# Altium project MEA_CLDP.PrjPcb (part 1 of 2)
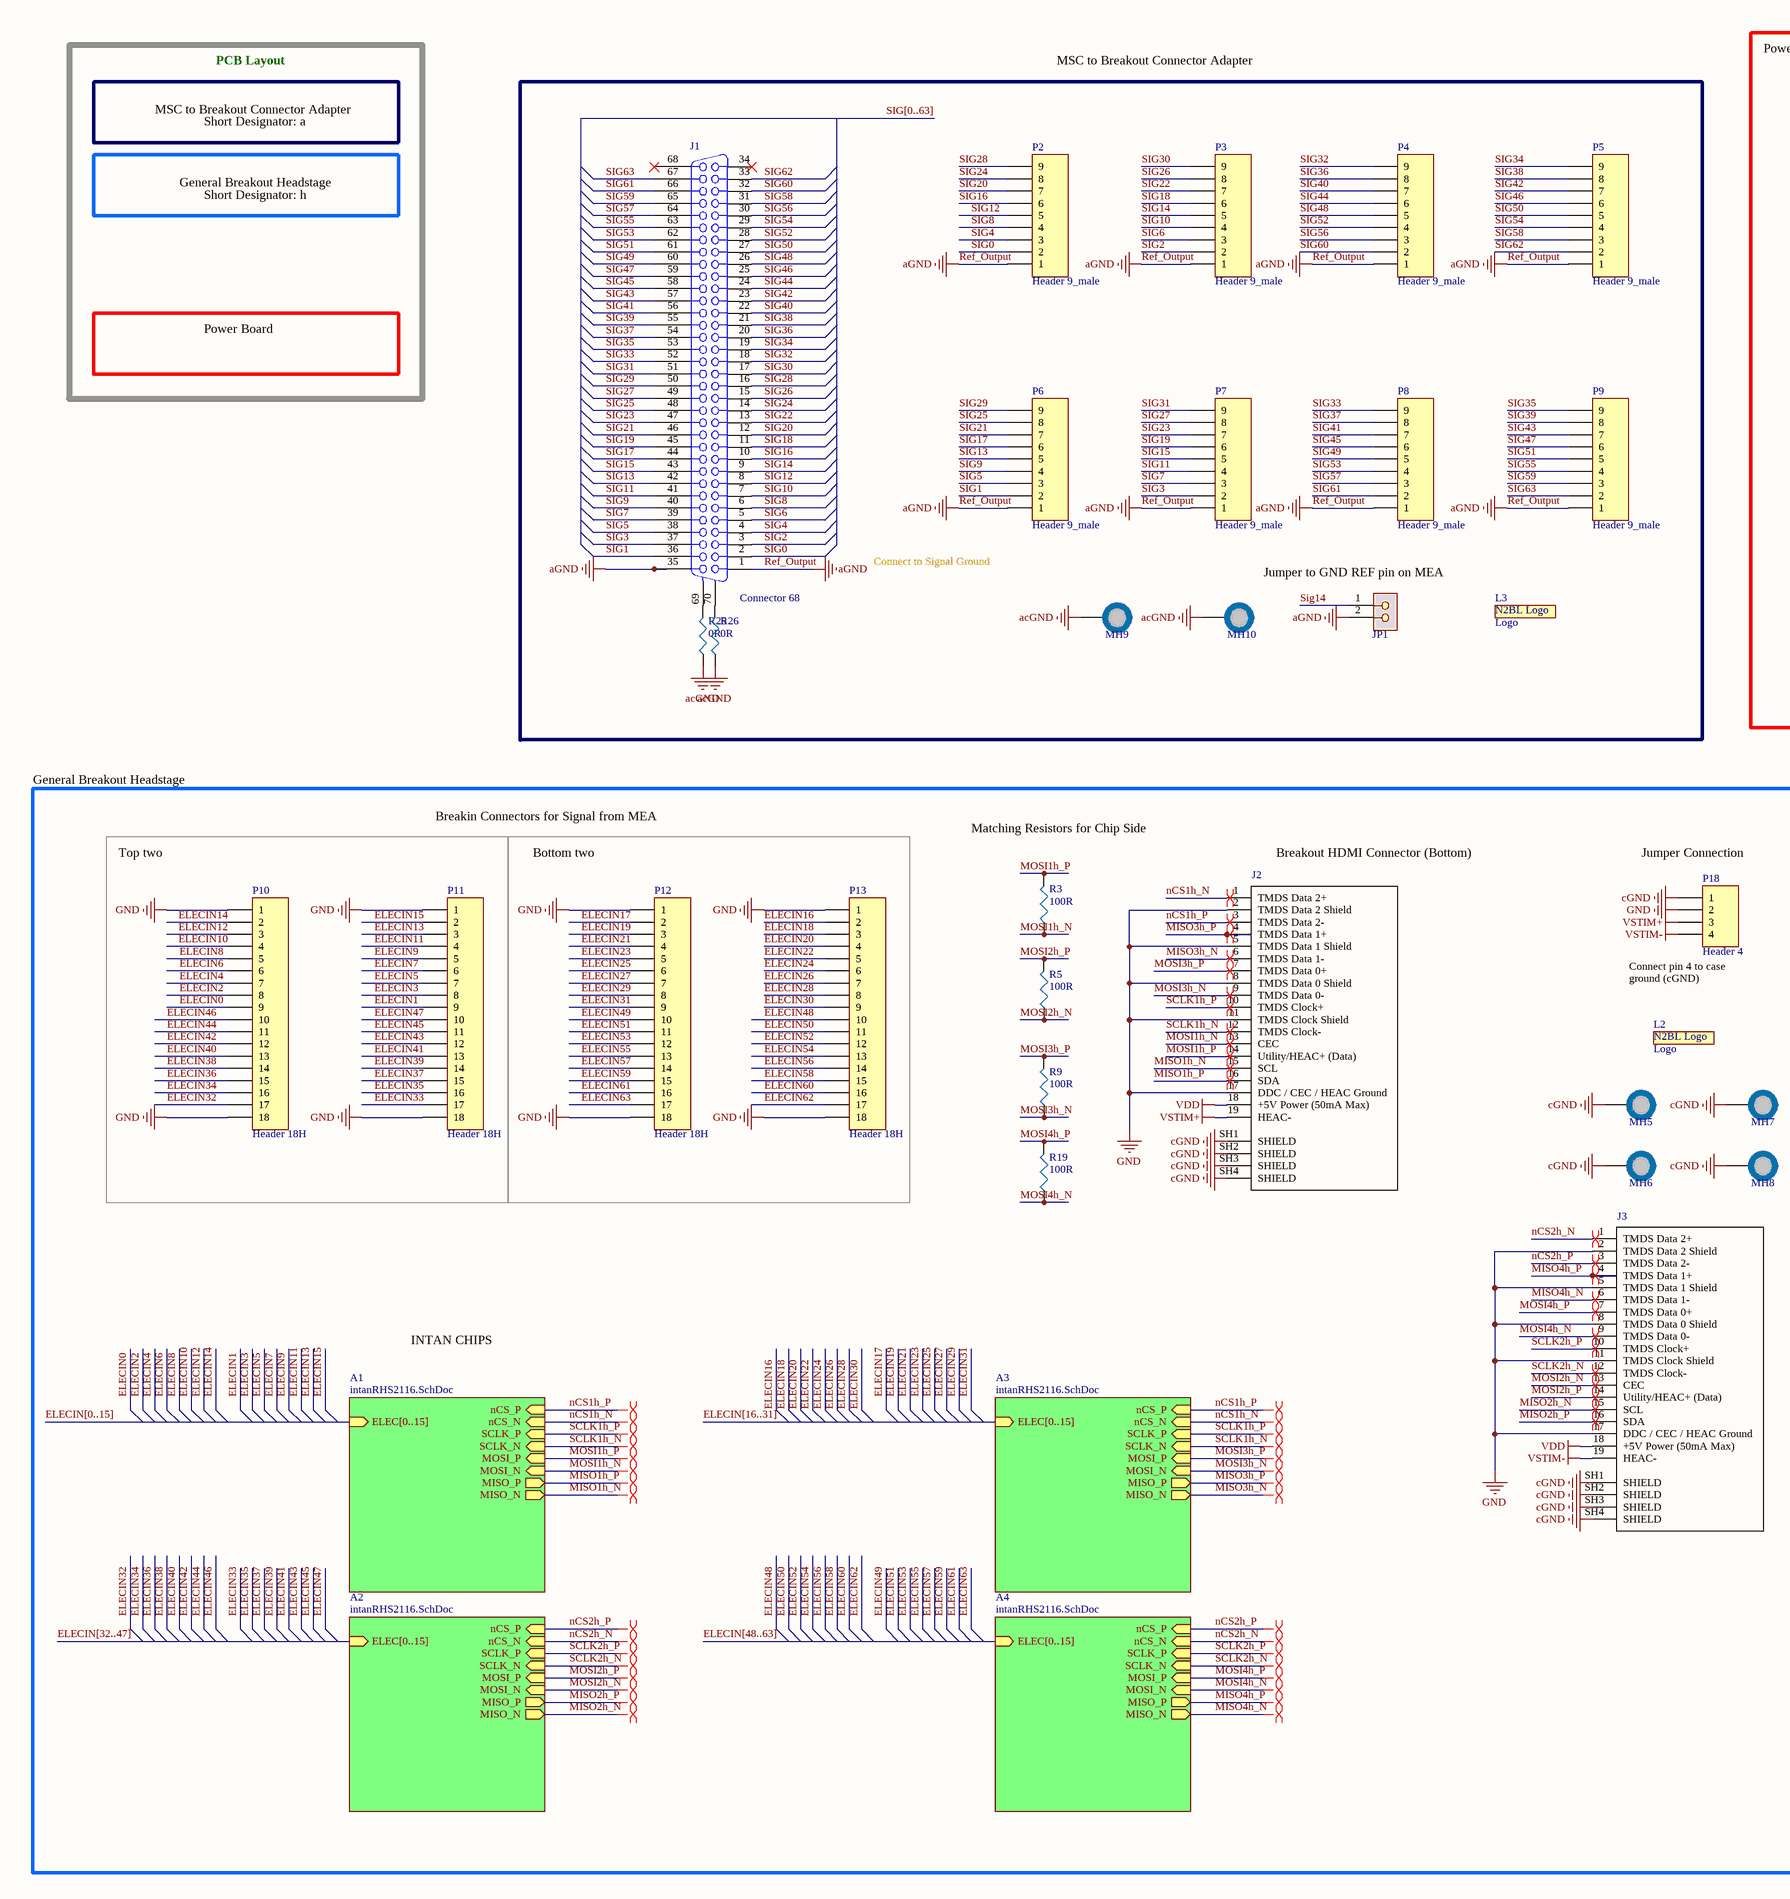
[diagram p0: MEA_CLDP.SchDoc, left]
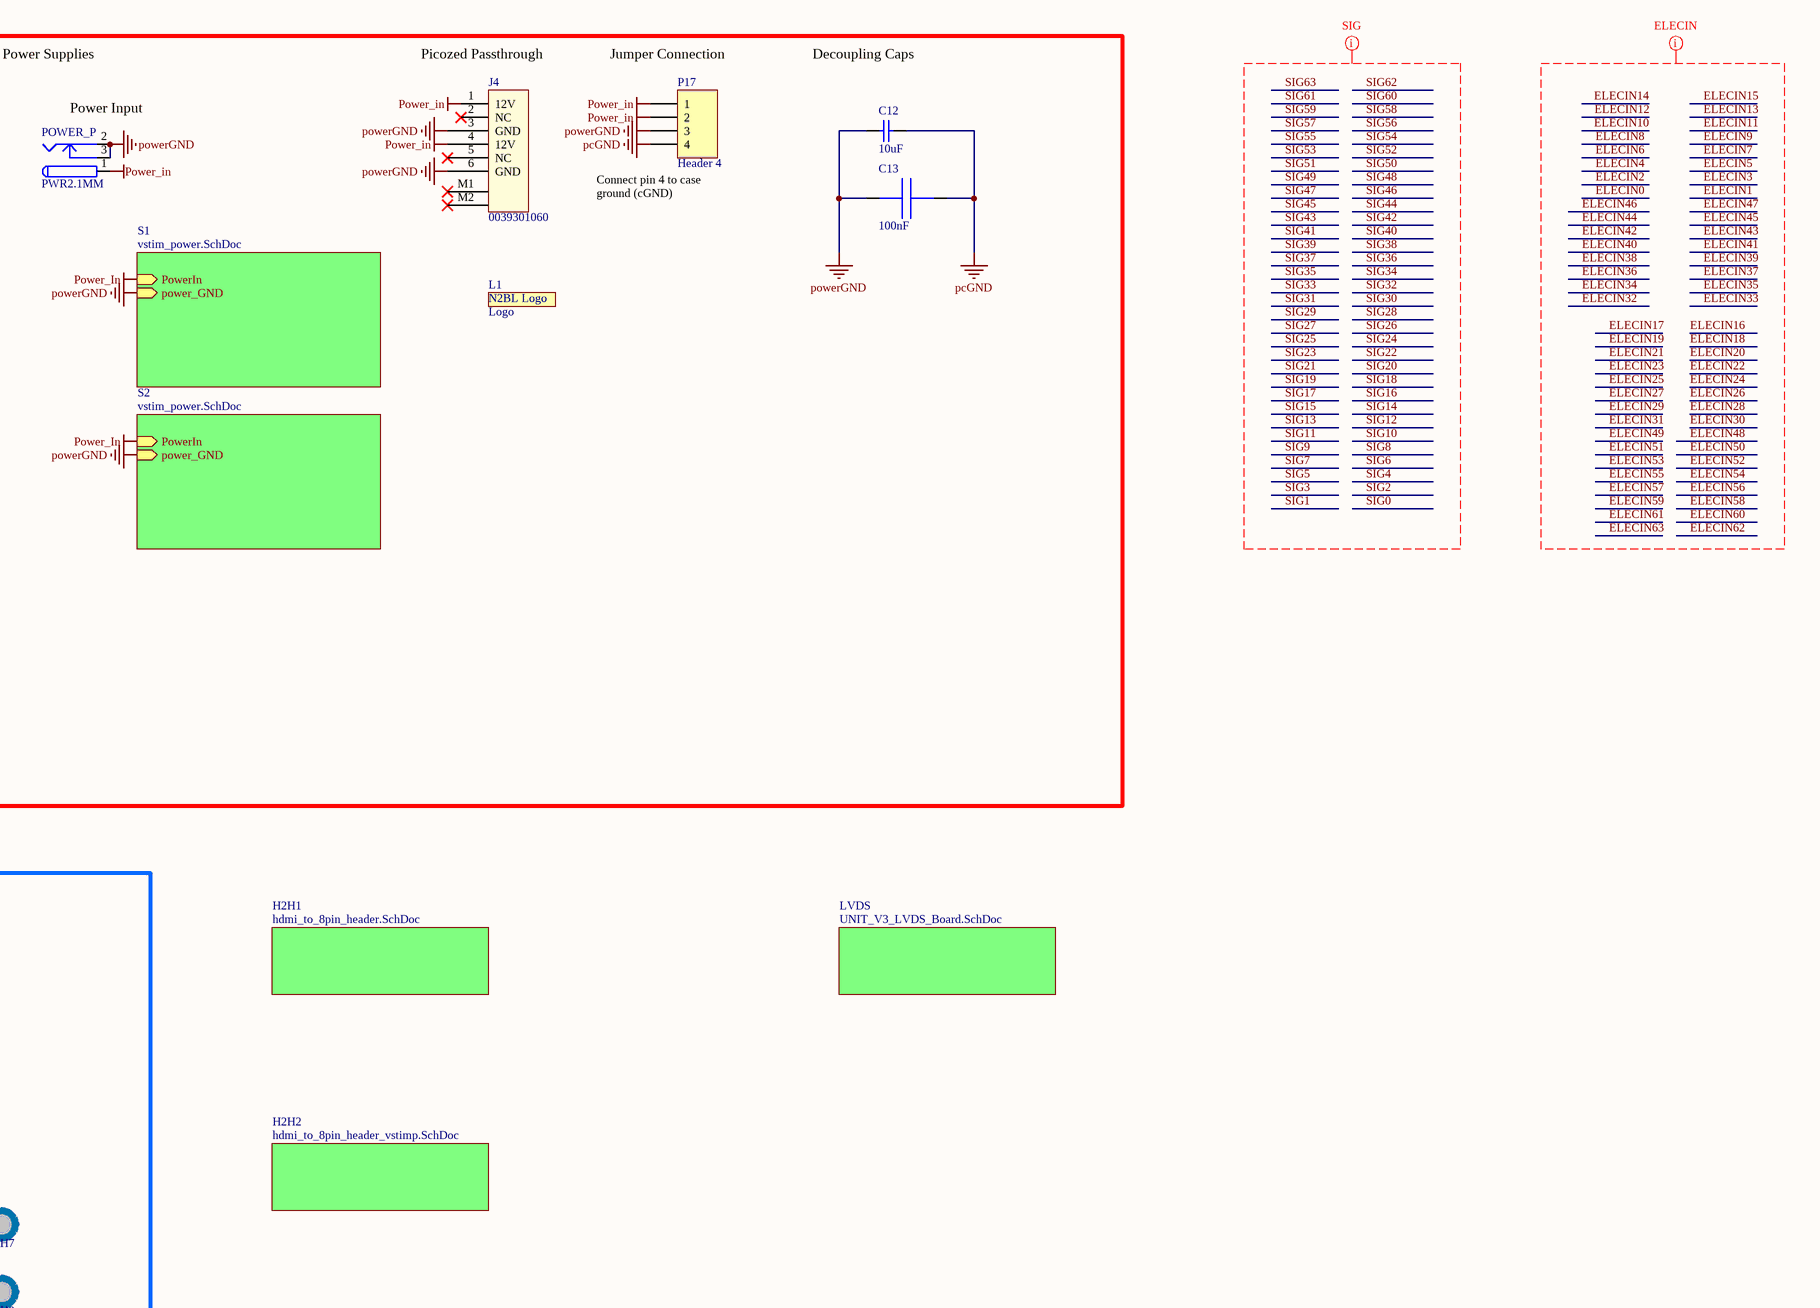
[diagram p1: MEA_CLDP.SchDoc, right]
5 sheets, 101 parts. Net scope: hierarchical (ports join the sheet entries above them; power ports are global).
Board file: MEA_CLDP.PcbDoc
Sheets:
  MEA_CLDP.SchDoc
    A1 = intanRHS2116.SchDoc
    A2 = intanRHS2116.SchDoc
    A3 = intanRHS2116.SchDoc
    A4 = intanRHS2116.SchDoc
    H2H1 = hdmi_to_8pin_header.SchDoc
    LVDS = UNIT_V3_LVDS_Board.SchDoc
    H2H2 = hdmi_to_8pin_header_vstimp.SchDoc

## Sheet MEA_CLDP.SchDoc
size A1

### Parts
C12  10uF  [C0805]
C13  value 100nF  [rcl_0402i_1005m_most]  (hidden comment: capacitor_npol_ame)
J1  Connector 68  [CONN_2-5174339-5_2-5174339-5(Primary)]
J2  1747981-2  [TE_1747981-2_1747981-2(Primary)]  (value not drawn)
J3  1747981-2  [TE_1747981-2_1747981-2(Primary)]  (value not drawn)
J4  0039301060  [0039301060]
JP1  01x02  [HDR1X2]  (value not drawn)
L1  Logo  [N2BL_LOGO]
L2  Logo  [N2BL_LOGO]
L3  Logo  [N2BL_LOGO]
MH5  MH_7.4MMC_3.2MMD  [MH_7.4MMD_3.2MMD]  (value not drawn)  (no BOM)
MH6  MH_7.4MMC_3.2MMD  [MH_7.4MMD_3.2MMD]  (value not drawn)  (no BOM)
MH7  MH_7.4MMC_3.2MMD  [MH_7.4MMD_3.2MMD]  (value not drawn)  (no BOM)
MH8  MH_7.4MMC_3.2MMD  [MH_7.4MMD_3.2MMD]  (value not drawn)  (no BOM)
MH9  MH_7.4MMC_3.2MMD  [MH_7.4MMD_3.2MMD]  (value not drawn)  (no BOM)
MH10  MH_7.4MMC_3.2MMD  [MH_7.4MMD_3.2MMD]  (value not drawn)  (no BOM)
P2  Header 9_male  [TE_3-644456-9]
P3  Header 9_male  [TE_3-644456-9]
P4  Header 9_male  [TE_3-644456-9]
P5  Header 9_male  [TE_3-644456-9]
P6  Header 9_male  [TE_3-644456-9]
P7  Header 9_male  [TE_3-644456-9]
P8  Header 9_male  [TE_3-644456-9]
P9  Header 9_male  [TE_3-644456-9]
P10  Header 18H  [PPPC181LFBN-RC]
P11  Header 18H  [PPPC181LFBN-RC]
P12  Header 18H  [PPPC181LFBN-RC]
P13  Header 18H  [PPPC181LFBN-RC]
P17  Header 4  [OSTVN04A150]
P18  Header 4  [OSTVN04A150]
POWER_P  PWR2.1MM  [POWER2.1MM]
R3  100R  [rcl_0402i_1005m_most]
R5  100R  [rcl_0402i_1005m_most]
R9  100R  [rcl_0402i_1005m_most]
R19  100R  [rcl_0402i_1005m_most]
R25  0R  [rcl_0402i_1005m_most]
R26  0R  [rcl_0402i_1005m_most]

### Blocks framed on the sheet
Bottom two: P12 P13

### Sub-sheets
A1 = intanRHS2116.SchDoc: ELEC[0..15] (in), nCS_P (in), nCS_N (in), SCLK_P (in), SCLK_N (in), MOSI_P (in), MOSI_N (in), MISO_P (out), MISO_N (out)
A2 = intanRHS2116.SchDoc: ELEC[0..15] (in), nCS_P (in), nCS_N (in), SCLK_P (in), SCLK_N (in), MOSI_P (in), MOSI_N (in), MISO_P (out), MISO_N (out)
A3 = intanRHS2116.SchDoc: ELEC[0..15] (in), nCS_P (in), nCS_N (in), SCLK_P (in), SCLK_N (in), MOSI_P (in), MOSI_N (in), MISO_P (out), MISO_N (out)
A4 = intanRHS2116.SchDoc: ELEC[0..15] (in), nCS_P (in), nCS_N (in), SCLK_P (in), SCLK_N (in), MOSI_P (in), MOSI_N (in), MISO_P (out), MISO_N (out)
H2H1 = hdmi_to_8pin_header.SchDoc: no entries
H2H2 = hdmi_to_8pin_header_vstimp.SchDoc: no entries
LVDS = UNIT_V3_LVDS_Board.SchDoc: no entries
S1 = vstim_power.SchDoc (file not in this document): PowerIn (in), power_GND (in)
S2 = vstim_power.SchDoc (file not in this document): PowerIn (in), power_GND (in)

### Nets
acGND: MH9.1 MH10.1 R25.1 R26.1
cGND: J2.SH1(SHIELD) J2.SH2(SHIELD) J2.SH3(SHIELD) J2.SH4(SHIELD) J3.SH1(SHIELD) J3.SH2(SHIELD) J3.SH3(SHIELD) J3.SH4(SHIELD) MH5.1 MH6.1 MH7.1 MH8.1 P18.1
GND: J2.2(TMDS_Data_2_Shield) J2.5(TMDS_Data_1_Shield) J2.8(TMDS_Data_0_Shield) J2.11(TMDS_Clock_Shield) J2.17(DDC_/_CEC_/_HEAC_Ground) J3.2(TMDS_Data_2_Shield) J3.5(TMDS_Data_1_Shield) J3.8(TMDS_Data_0_Shield) J3.11(TMDS_Clock_Shield) J3.17(DDC_/_CEC_/_HEAC_Ground) P10.1 P10.18 P11.1 P11.18 P12.1 P12.18 P13.1 P13.18 P18.2
pcGND: C12.1 C13.1 P17.4
Power_In: J4.1(12V) J4.4(12V) P17.1 P17.2 POWER_P.1 ; sheet S1/PowerIn, sheet S2/PowerIn
powerGND: C12.2 C13.2 J4.3(GND) J4.6(GND) P17.3 POWER_P.2 POWER_P.3 ; sheet S1/power_GND, sheet S2/power_GND
Ref_Output: J1.1 J1.35 JP1.2 P2.1 P3.1 P4.1 P5.1 P6.1 P7.1 P8.1 P9.1  [also labelled aGND]
VDD: J2.18(+5V_Power_(50mA_Max)) J3.18(+5V_Power_(50mA_Max))
VSTIM+: J2.19(HEAC-) P18.3
VSTIM-: J3.19(HEAC-) P18.4
ELECIN0: P10.9  [project net ELEC0]
ELECIN1: P11.9  [project net ELEC1]
ELECIN2: P10.8  [project net ELEC2]
ELECIN3: P11.8  [project net ELEC3]
ELECIN4: P10.7  [project net ELEC4]
ELECIN5: P11.7  [project net ELEC5]
ELECIN6: P10.6  [project net ELEC6]
ELECIN7: P11.6  [project net ELEC7]
ELECIN8: P10.5  [project net ELEC8]
ELECIN9: P11.5  [project net ELEC9]
ELECIN10: P10.4  [project net ELEC10]
ELECIN11: P11.4  [project net ELEC11]
ELECIN12: P10.3  [project net ELEC12]
ELECIN13: P11.3  [project net ELEC13]
ELECIN14: P10.2  [project net ELEC14]
ELECIN15: P11.2  [project net ELEC15]
ELECIN16: P13.2  [project net ELEC0]
ELECIN17: P12.2  [project net ELEC1]
ELECIN18: P13.3  [project net ELEC2]
ELECIN19: P12.3  [project net ELEC3]
ELECIN20: P13.4  [project net ELEC4]
ELECIN21: P12.4  [project net ELEC5]
ELECIN22: P13.5  [project net ELEC6]
ELECIN23: P12.5  [project net ELEC7]
ELECIN24: P13.6  [project net ELEC8]
ELECIN25: P12.6  [project net ELEC9]
ELECIN26: P13.7  [project net ELEC10]
ELECIN27: P12.7  [project net ELEC11]
ELECIN28: P13.8  [project net ELEC12]
ELECIN29: P12.8  [project net ELEC13]
ELECIN30: P13.9  [project net ELEC14]
ELECIN31: P12.9  [project net ELEC15]
ELECIN32: P10.17  [project net ELEC0]
ELECIN33: P11.17  [project net ELEC1]
ELECIN34: P10.16  [project net ELEC2]
ELECIN35: P11.16  [project net ELEC3]
ELECIN36: P10.15  [project net ELEC4]
ELECIN37: P11.15  [project net ELEC5]
ELECIN38: P10.14  [project net ELEC6]
ELECIN39: P11.14  [project net ELEC7]
ELECIN40: P10.13  [project net ELEC8]
ELECIN41: P11.13  [project net ELEC9]
ELECIN42: P10.12  [project net ELEC10]
ELECIN43: P11.12  [project net ELEC11]
ELECIN44: P10.11  [project net ELEC12]
ELECIN45: P11.11  [project net ELEC13]
ELECIN46: P10.10  [project net ELEC14]
ELECIN47: P11.10  [project net ELEC15]
ELECIN48: P13.10  [project net ELEC0]
ELECIN49: P12.10  [project net ELEC1]
ELECIN50: P13.11  [project net ELEC2]
ELECIN51: P12.11  [project net ELEC3]
ELECIN52: P13.12  [project net ELEC4]
ELECIN53: P12.12  [project net ELEC5]
ELECIN54: P13.13  [project net ELEC6]
ELECIN55: P12.13  [project net ELEC7]
ELECIN56: P13.14  [project net ELEC8]
ELECIN57: P12.14  [project net ELEC9]
ELECIN58: P13.15  [project net ELEC10]
ELECIN59: P12.15  [project net ELEC11]
ELECIN60: P13.16  [project net ELEC12]
ELECIN61: P12.16  [project net ELEC13]
ELECIN62: P13.17  [project net ELEC14]
ELECIN63: P12.17  [project net ELEC15]
MISO1h_N: J2.15(SCL) ; sheet A1/MISO_N
MISO1h_P: J2.16(SDA) ; sheet A1/MISO_P
MISO2h_N: J3.15(SCL) ; sheet A2/MISO_N
MISO2h_P: J3.16(SDA) ; sheet A2/MISO_P
MISO3h_N: J2.6(TMDS_Data_1-) ; sheet A3/MISO_N
MISO3h_P: J2.4(TMDS_Data_1+) ; sheet A3/MISO_P
MISO4h_N: J3.6(TMDS_Data_1-) ; sheet A4/MISO_N
MISO4h_P: J3.4(TMDS_Data_1+) ; sheet A4/MISO_P
MOSI1h_N: J2.13(CEC) R3.1 ; sheet A1/MOSI_N
MOSI1h_P: J2.14(Utility/HEAC+_(Data)) R3.2 ; sheet A1/MOSI_P
MOSI2h_N: J3.13(CEC) R5.1 ; sheet A2/MOSI_N
MOSI2h_P: J3.14(Utility/HEAC+_(Data)) R5.2 ; sheet A2/MOSI_P
MOSI3h_N: J2.9(TMDS_Data_0-) R9.1 ; sheet A3/MOSI_N
MOSI3h_P: J2.7(TMDS_Data_0+) R9.2 ; sheet A3/MOSI_P
MOSI4h_N: J3.9(TMDS_Data_0-) R19.1 ; sheet A4/MOSI_N
MOSI4h_P: J3.7(TMDS_Data_0+) R19.2 ; sheet A4/MOSI_P
nCS1h_N: J2.1(TMDS_Data_2+) ; sheet A1/nCS_N, sheet A3/nCS_N
nCS1h_P: J2.3(TMDS_Data_2-) ; sheet A1/nCS_P, sheet A3/nCS_P
nCS2h_N: J3.1(TMDS_Data_2+) ; sheet A2/nCS_N, sheet A4/nCS_N
nCS2h_P: J3.3(TMDS_Data_2-) ; sheet A2/nCS_P, sheet A4/nCS_P
SCLK1h_N: J2.12(TMDS_Clock-) ; sheet A1/SCLK_N, sheet A3/SCLK_N
SCLK1h_P: J2.10(TMDS_Clock+) ; sheet A1/SCLK_P, sheet A3/SCLK_P
SCLK2h_N: J3.12(TMDS_Clock-) ; sheet A2/SCLK_N, sheet A4/SCLK_N
SCLK2h_P: J3.10(TMDS_Clock+) ; sheet A2/SCLK_P, sheet A4/SCLK_P
SIG0: J1.2 P2.2
SIG1: J1.36 P6.2
SIG2: J1.3 P3.2
SIG3: J1.37 P7.2
SIG4: J1.4 P2.3
SIG5: J1.38 P6.3
SIG6: J1.5 P3.3
SIG7: J1.39 P7.3
SIG8: J1.6 P2.4
SIG9: J1.40 P6.4
SIG10: J1.7 P3.4
SIG11: J1.41 P7.4
SIG12: J1.8 P2.5
SIG13: J1.42 P6.5
SIG14: J1.9 JP1.1 P3.5
SIG15: J1.43 P7.5
SIG16: J1.10 P2.6
SIG17: J1.44 P6.6
SIG18: J1.11 P3.6
SIG19: J1.45 P7.6
SIG20: J1.12 P2.7
SIG21: J1.46 P6.7
SIG22: J1.13 P3.7
SIG23: J1.47 P7.7
SIG24: J1.14 P2.8
SIG25: J1.48 P6.8
SIG26: J1.15 P3.8
SIG27: J1.49 P7.8
SIG28: J1.16 P2.9
SIG29: J1.50 P6.9
SIG30: J1.17 P3.9
SIG31: J1.51 P7.9
SIG32: J1.18 P4.9
SIG33: J1.52 P8.9
SIG34: J1.19 P5.9
SIG35: J1.53 P9.9
SIG36: J1.20 P4.8
SIG37: J1.54 P8.8
SIG38: J1.21 P5.8
SIG39: J1.55 P9.8
SIG40: J1.22 P4.7
SIG41: J1.56 P8.7
SIG42: J1.23 P5.7
SIG43: J1.57 P9.7
SIG44: J1.24 P4.6
SIG45: J1.58 P8.6
SIG46: J1.25 P5.6
SIG47: J1.59 P9.6
SIG48: J1.26 P4.5
SIG49: J1.60 P8.5
SIG50: J1.27 P5.5
SIG51: J1.61 P9.5
SIG52: J1.28 P4.4
SIG53: J1.62 P8.4
SIG54: J1.29 P5.4
SIG55: J1.63 P9.4
SIG56: J1.30 P4.3
SIG57: J1.64 P8.3
SIG58: J1.31 P5.3
SIG59: J1.65 P9.3
SIG60: J1.32 P4.2
SIG61: J1.66 P8.2
SIG62: J1.33 P5.2
SIG63: J1.67 P9.2
NetJ1_69: J1.69(MH1) R25.2
NetJ1_70: J1.70(MH2) R26.2

Not connected (* = marked no-connect by the designer): J1 34* 68*; J4 2(NC)* 5(NC)* M1* M2*

### Buses and harness runs
bus ELECIN[0..15] = sheet A1/ELEC[0..15]
bus ELECIN[16..31] = sheet A3/ELEC[0..15]
bus ELECIN[32..47] = sheet A2/ELEC[0..15]
bus ELECIN[48..63] = sheet A4/ELEC[0..15]
bus SIG[0..63]

### Layout directives
differential pair: MISO1h_N, MISO1h_P, MISO2h_N, MISO2h_P, MISO3h_N, MISO3h_P, MISO4h_N, MISO4h_P, MOSI1h_N, MOSI1h_P, MOSI2h_N, MOSI2h_P, MOSI3h_N, MOSI3h_P, MOSI4h_N, MOSI4h_P, nCS1h_N, nCS1h_P, nCS2h_N, nCS2h_P, SCLK1h_N, SCLK1h_P, SCLK2h_N, SCLK2h_P
net class SIG_ALL: SIG0, SIG1, SIG2, SIG3, SIG4, SIG5, SIG6, SIG7, SIG8, SIG9, SIG10, SIG11, SIG12, SIG13, SIG14, SIG15, SIG16, SIG17, SIG18, SIG19, SIG20, SIG21, SIG22, SIG23, SIG24, SIG25, SIG26, SIG27, SIG28, SIG29, SIG30, SIG31, SIG32, SIG33, SIG34, SIG35, SIG36, SIG37, SIG38, SIG39, SIG40, SIG41, SIG42, SIG43, SIG44, SIG45, SIG46, SIG47, SIG48, SIG49, SIG50, SIG51, SIG52, SIG53, SIG54, SIG55, SIG56, SIG57, SIG58, SIG59, SIG60, SIG61, SIG62, SIG63
net class ELECIN_ALL: ELECIN0, ELECIN1, ELECIN2, ELECIN3, ELECIN4, ELECIN5, ELECIN6, ELECIN7, ELECIN8, ELECIN9, ELECIN10, ELECIN11, ELECIN12, ELECIN13, ELECIN14, ELECIN15, ELECIN16, ELECIN17, ELECIN18, ELECIN19, ELECIN20, ELECIN21, ELECIN22, ELECIN23, ELECIN24, ELECIN25, ELECIN26, ELECIN27, ELECIN28, ELECIN29, ELECIN30, ELECIN31, ELECIN32, ELECIN33, ELECIN34, ELECIN35, ELECIN36, ELECIN37, ELECIN38, ELECIN39, ELECIN40, ELECIN41, ELECIN42, ELECIN43, ELECIN44, ELECIN45, ELECIN46, ELECIN47, ELECIN48, ELECIN49, ELECIN50, ELECIN51, ELECIN52, ELECIN53, ELECIN54, ELECIN55, ELECIN56, ELECIN57, ELECIN58, ELECIN59, ELECIN60, ELECIN61, ELECIN62, ELECIN63

### Notes on the sheet
- PCB Layout
- MSC to Breakout Connector Adapter
- Power Supplies
- (near J4) Picozed Passthrough
- (near P17) Jumper Connection
- Decoupling Caps
- Short Designator: a
- (near POWER_P) Power Input
- General Breakout Headstage
- Short Designator: h
- (near P17) Connect pin 4 to case ground (cGND)
- Power Board
- Connect to Signal Ground
- (near JP1) Jumper to GND REF pin on MEA
- Breakin Connectors for Signal from MEA
- Top two
- Matching Resistors for Chip Side
- (near J2) Breakout HDMI Connector (Bottom)
- (near P18) Jumper Connection
- (near P18) Connect pin 4 to case ground (cGND)
- INTAN CHIPS
- (in symbol Neuron To Brain Lab Logo) N2BL Logo

### Library data of the parts
C12 = C2012X5R1E106K085AC: CAP 10UF; Manufacturer: Samsung Electro-Mechanics; Manufacturer Part Number: CL21A106KAYNNNE; Dielectric Material: Ceramic; Tolerance: 10%; Voltage Rating: 25V; Dielectric: X5R; Supplier 1: Digi-Key; Stock 1: 843; Pricing 1: 1=0.39;  10=0.264;  100=0.13340;  500=0.09128;  1000=0.08075  (CAD); Mount: Surface Mount; Case/Package: 0805; Case Code (Metric): 2012; Case Code (Imperial): 0805; Min Operating Temperature: -55°C; Max Operating Temperature: 85°C; Packaging: Tape and Reel; Capacitance: 10uF; Termination: SMD/SMT; Voltage Rating (DC): 25V; Length: 0.079inch; Width: 0.049inch; Thickness: 1.25mm; Lead Free: Lead Free; ComponentLink1URL: http://www.samsungsem.com/kr/support/product-search/mlcc/__icsFiles/afieldfile/2018/06/20/CL21A106KAYNNNE.pdf; ComponentLink1Description: Specifications; ComponentLink2URL: https://media.digikey.com/pdf/Data%20Sheets/Samsung%20PDFs/CL21A106KAYNNNE_Char.pdf; ComponentLink2Description: Characteristics; ComponentLink3URL: https://media.digikey.com/pdf/Data%20Sheets/Samsung%20PDFs/CL_Series_MLCC_ds.pdf; ComponentLink3Description: Datasheet; Supplier Part Number 1: 1276-2891-1-ND; Supplier Link 1: https://www.digikey.ca/product-detail/en/samsung-electro-mechanics/CL21A106KAYNNNE/1276-2891-1-ND/3890977
C13 = capacitor_npol_ame: Capacitor Non-polarized American Symbol; Manufacturer: Yageo; Manuracturer Part Number: CC0402KRX7R8BB104; Voltage Rating: 25V; Priging 1: 1 	0.15000 	$0.15 (CAD); Package: 0402; Supplier 1: Digikey; Supplier Part Number 1: 311-2077-1-ND; Supplier Link 1: https://www.digikey.ca/product-detail/en/yageo/CC0402KRX7R8BB104/311-2077-1-ND/5698948; Stock 1: 143,749; ComponentLink1URL: http://www.yageo.com/documents/recent/UPY-GPHC_X7R_6.3V-to-50V_18.pdf; ComponentLink1Description: Datasheet; Supplier Description 1: CAP CER 0.1UF 25V X7R 0402
J1 = Connector 68: Receptacle Header Assemby; Manufacturer: TE Connectivity; Manufacturer Part Number: 2-5174339-5; Pricing1: 1=29.61;  10=26.727;  25=25.60760;  50=24.007  (CAD); Supplier 1: Digi-Key; ComponentLink1Description: Datasheet; ComponentLink1URL: https://www.te.com/commerce/DocumentDelivery/DDEController?Action=srchrtrv&DocNm=5174339&DocType=Customer+Drawing&DocLang=English; Stock1: 1335; Supplier Link 1: https://www.digikey.ca/product-detail/en/te-connectivity-amp-connectors/2-5174339-5/A121355-ND/1835651; Manufacturer Link: https://www.te.com/usa-en/product-2-5174339-5.html#pdp-docs-features; Supplier Part Number 1: A121355-ND
J2 J3 = 1747981-2: Conn HDMI RCP 19 POS 0.5mm Solder ST SMD 19 Terminal 1 Port T/R; MF: TE Connectivity; Detailed Description: HDMI Receptacle Connector 19 Position Panel Mount; Surface Mount, Right Angle; Through Hole; Pricing1: 1  6.31000  $6.31  10  6.04800  $60.48  25  5.54400  $138.60  50  5.29240  $264.62  100  5.04030  $504.03 (CAD); TE_purchase_URL: https://www.te.com/usa-en/product-1747981-2.html?te_bu=Cor&te_type=disp&te_campaign=seda_glo_cor-seda-global-disp-prtnr-fy19-seda-model-bom-cta_sma-317_1&elqCampaignId=32493; SnapEDA_Link: https://www.snapeda.com/parts/1747981-2/TE%20Connectivity%20AMP%20Connectors/view-part/?ref=snap; Package: None; MP: 1747981-2; EU_RoHS_Compliance: Compliant; Availability: Unavailable; Price: None; Value: *; ComponentLink1Description: Datasheet; ComponentLink1URL: https://www.te.com/commerce/DocumentDelivery/DDEController?Action=srchrtrv&DocNm=1747981&DocType=Customer+Drawing&DocLang=English; Manufacturer: TE Connectivity; Manufacturer Part Number: 1747981-2; Stock1: 1,426; Supplier 1: Digikey; Supplier Link 1: https://www.digikey.ca/product-detail/en/te-connectivity-amp-connectors/1747981-2/A130924CT-ND/8602669; Supplier Part Number 1: A130924CT-ND
J4 = 0039301060: CONN HEADER R/A 6POS 4.2MM; Manufacturer: Molex; Pricing1: 1  1.41000  $1.41  10  1.25000  $12.50  100  1.07790  $107.79  500  0.88194  $440.97  1,000  0.78394  $783.94  5,000  0.68595  $3,429.73  10,000  0.65165  $6,516.48 (CAD); Manufacturer Part Number: 0039301060; Supplier Link 1: https://www.digikey.ca/product-detail/en/molex/0039301060/WM1353-ND/561080; Supplier 1: Digikey; Supplier Part Number 1: WM1353-ND; Stock1: 8,844; ComponentLink1URL: https://www.molex.com/pdm_docs/sd/039301060_sd.pdf; ComponentLink1Description: Datasheet
JP1 = 01x02: 01X02 generic terminal connector
L1-L3 = Neuron To Brain Lab Logo
MH5-MH10 = MH_7.4MMC_3.2MMC: Mounting Hole 7.4mm Diameter, 3.2mm Drill
P2-P9 = Header 9_male: Header, 9-Pin; Manufacturer: TE Connectivity AMP Connectors; Manufacturer Part Number: 3-644456-9; Manufacturer Link: https://www.te.com/global-en/product-3-644456-9.html; Supplier 1: Digikey; Supplier Link 1: https://www.digikey.ca/product-detail/en/te-connectivity-amp-connectors/3-644456-9/A31119-ND/698351; Supplier Part Number 1: A31119-ND; Stock1: 6,446; Price1: 1=0.81000;  10=0.76300;  100=0.58520;  500=0.50888;  1,000=0.41984;  5,000=0.36894;  10,000=0.34350 (CAD); ComponentLink1URL: https://www.te.com/commerce/DocumentDelivery/DDEController?Action=srchrtrv&DocNm=644456&DocType=Customer+Drawing&DocLang=English; ComponentLink1Description: Datasheet
P10-P13 = Header 18H: CONN RCPT 18POS 0.1 GOLD PCB; Manufacturer: Sullins Connector Solutions; Pricing1: 1 	1.63000 	$1.63; Publisher: Altium Limited; Manufacturer Part Number: PPPC181LFBN-RC; Supplier 1: Digikey; Supplier Part Number 1: S7051-ND; ComponentLink1URL: https://drawings-pdf.s3.amazonaws.com/10492.pdf; ComponentLink2URL: https://media.digikey.com/pdf/Data%20Sheets/Sullins%20PDFs/Female_Headers.100_DS.pdf; ComponentLink1Description: Datasheet Drawing; ComponentLink2Description: Datasheet General Headers; Stock1: 1,744; Supplier Link 1: https://www.digikey.ca/product-detail/en/sullins-connector-solutions/PPPC181LFBN-RC/S7051-ND/810190; Manufacturer Link 1: https://www.sullinscorp.com/product/?pn=PPPC181LFBN-RC&toggle=in
P17 P18 = Header 4: Header, 4-Pin; Manufacturer: On Shore Technology Inc.; Detailed Description: 4 Position Wire to Board Terminal Block Horizontal with Board 0.100" (2.54mm) Through Hole; Pitch (Imperial): 100mil; LatestRevisionDate: 17-Jul-2002; LatestRevisionNote: Re-released for DXP Platform.; Publisher: Altium Limited; Manufacturer Part Number: OSTVN04A150; Manufacturer Link: https://www.on-shore.com/part/ostvnxxa150-terminal-block-one-piece-rising-clamp/; Supplier 1: Digikey; Supplier Link 1: https://www.digikey.com/product-detail/en/on-shore-technology-inc/OSTVN04A150/ED10563-ND/1588864; Supplier Part Number 1: ED10563-ND; Pricing 1: 1  1.38000  $1.38  10  0.96900  $9.69  25  0.90400  $22.60  50  0.82040  $41.02  100  0.81680  $81.68  250  0.68972  $172.43  500  0.65340  $326.70  1,000  0.58080  $580.80  5,000  0.47190  $2,359.50 (CAD); Stock 1: 8,195; ComponentLink1URL: http://www.on-shore.com/wp-content/uploads/OSTVNXXA150.pdf; ComponentLink1Description: Datasheet
POWER_P = PWR2.1MM: PJ-002AH; Manufacturer: CUI; Gender: Male; Shielding: Unshielded; Connector Type: Jack; Current Rating: 5A; Number of Conductors: 2; Voltage Rating: 24V; Insulation Resistance: 50MR; Supplier 1: Digi-Key; Manufacturer Part Number: PJ-002AH; Stock 1: 95768; Pricing 1: 1=0.74, 10=0.696, 25=0.6264, 50=0.5568, 100=0.5336, 250=0.4872, 500=0.464, 1000=0.3828, 2500=0.348 (USD); Mount: Through Hole; Colour: Black; Contact Material: Copper,Copper Alloy; Contact Plating: Nickel; Housing Material: Thermoplastic; Housing Colour: Black; Min Operating Temperature: -25°C; Max Operating Temperature: 85°C; Packaging: Bulk; Termination: Through Hole; Orientation: Horizontal; Package Quantity: 500; Contact Gender: Male; Diameter: 2.1mm; Lead Free: Lead Free; Flammability Rating: UL94 V-0; ComponentLink1URL: http://www.cui.com/Product/Resource/FuturePDF/PJ-002AH.pdf; ComponentLink1Description: http://www.cui.com/Product/Resource/FuturePDF/PJ-002AH.pdf; ComponentLink2URL: http://www.cui.com/product/resource/digikeypdf/pj-002ah.pdf; ComponentLink2Description: http://www.cui.com/product/resource/digikeypdf/pj-002ah.pdf; ComponentLink3URL: http://www.mouser.com/ds/2/670/pj-002ah-516007.pdf; ComponentLink3Description: http://www.mouser.com/ds/2/670/pj-002ah-516007.pdf; Supplier Part Number 1: CP-002AH-ND; Supplier Link 1: https://www.digikey.ca/products/en?keywords=CP-002AH-ND
R3 R5 R9 R19 = RES100: RES SMD 100 OHM 1% 1/16W 0402; Manufacturer: Vishay Dale; Manufacturer Part Number: CRCW0402100RFKED; Temperature Coefficient: 100ppm/°C; Power Rating: 0.063W; Voltage Rating: 50V; Assembly Note: If Vishay Dale part not in stock as free passive part, use Panasonic resistor instead; Tolorance 2: 0.5%; Supplier 1: 7PCB/Bittle; Stock 1: 0; Pricing 1: Free; Case/Package: 0402; Case Code (Metric): 1005; Case Code (Imperial): 0402; Min Operating Temperature: -55°C; Max Operating Temperature: 155°C; Tolerance 1: 1%; Resistance: 100R; Packaging: Paper Tape; Composition: Thick Film; Package Quantity: 1; Number of Terminations: 2; Termination: SMD/SMT; Military Standard: Not; Max Power Dissipation: 0.063W; REACH SVHC: Unknown; Lead Free: Lead Free; ComponentLink1URL: http://www.vishay.com/docs/20035/dcrcwe3.pdf; ComponentLink1Description: Datasheet 1; Supplier Part Number 1: CRCW0402100RFKED; Weight: 4mg; Length: 1mm; Width: 0.5mm; Supplier Link 1: https://parts.7pcb.com/; Supplier Description 1: RES SMD 100 OHM 1% 1/16W 0402; Height: 0.4mm; Manufacturer 2: Panasonic Electronic Components; Manufacturer Part Number 2: ERA-2AED101X; ComponentLink2URL: https://industrial.panasonic.com/cdbs/www-data/pdf/RDM0000/AOA0000C307.pdf; ComponentLink2Description: Datasheet 2; Supplier 2: Digi-Key; Supplier Part Number 2: P100DECT-ND; Supplier Description 2: 100 Ohms ±0.5% 0.063W, 1/16W Chip Resistor 0402 (1005 Metric) Automotive AEC-Q200 Thin Film; Pricing 2: 1  0.34000  $0.34  10  0.29100  $2.91  100  0.11370  $11.37  1,000  0.04762  $47.62  2,500  0.04364  $109.11  5,000  0.03968  $198.40
R25 R26 = RES100: RES SMD 0 OHM JUMPER 1/16W 0402; Manufacturer: Vishay Dale; Manufacturer Part Number: CRCW04020000Z0ED; Tolerance 1: 1%; Resistance: 100R; Temperature Coefficient: 100ppm/°C; Power Rating: 0.063W; Voltage Rating: 50V; Tolorance 2: 0.5%; Supplier 1: 7PCB/Bittle; Stock 1: 1271266; Pricing 1: Free; Case/Package: 0402; Case Code (Metric): 1005; Case Code (Imperial): 0402; Min Operating Temperature: -55°C; Max Operating Temperature: 155°C; Packaging: Paper Tape; Composition: Thick Film; Package Quantity: 1; Number of Terminations: 2; Termination: SMD/SMT; Military Standard: Not; Max Power Dissipation: 0.063W; REACH SVHC: Unknown; Lead Free: Lead Free; ComponentLink1URL: http://www.vishay.com/docs/20035/dcrcwe3.pdf; ComponentLink1Description: Datasheet 1; Supplier Part Number 1: CRCW04020000Z0ED; Length: 1mm; Width: 0.5mm; Supplier Link 1: https://parts.7pcb.com/; Supplier Description 1: RES SMD 0.0OHM JUMPER 1/16W 0402; Height: 0.4mm

## Sheet intanRHS2116.SchDoc
size A4
Used 4 times, as channels A1, A2, A3, A4. Parts and nets are listed once, with the designators drawn on the sheet.
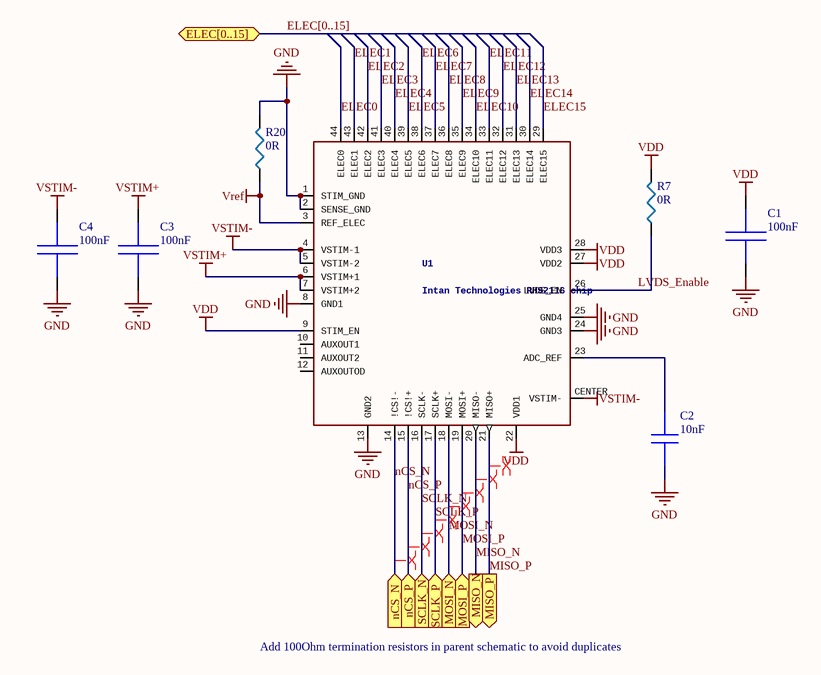
[diagram p2: intanRHS2116.SchDoc]

### Parts
C1  value 100nF  [rcl_0402i_1005m_most]  (hidden comment: capacitor_npol_ame)
C2  value 10nF  [rcl_0402i_1005m_most]  (hidden comment: capacitor_npol_ame_10n)
C3  value 100nF  [rcl_0402i_1005m_most]  (hidden comment: capacitor_npol_ame)
C4  value 100nF  [rcl_0402i_1005m_most]  (hidden comment: capacitor_npol_ame)
R7  0R  [rcl_0402i_1005m_most]
R20  0R  [rcl_0402i_1005m_most]
U1  Intan Technologies RHS2116 chip  [QFN44_7_X_7]

### Ports
ELEC[0..15] (bidir), MISO_N (out), MISO_P (out), MOSI_N (in), MOSI_P (in), nCS_N (in), nCS_P (in), SCLK_N (in), SCLK_P (in)

### Nets
GND: C1.1 C2.1 C3.1 C4.1 R20.2 U1.1(STIM_GND) U1.2(SENSE_GND) U1.8(GND1) U1.13(GND2) U1.24(GND3) U1.25(GND4)
VDD: C1.2 R7.2 U1.9(STIM_EN) U1.22(VDD1) U1.27(VDD2) U1.28(VDD3)
Vref: R20.1 U1.3(REF_ELEC)
VSTIM+: C3.2 U1.6(VSTIM+1) U1.7(VSTIM+2)
VSTIM-: C4.2 U1.4(VSTIM-1) U1.5(VSTIM-2) U1.CENTER(VSTIM-)
ELEC0: U1.44(ELEC0)
ELEC1: U1.43(ELEC1)
ELEC2: U1.42(ELEC2)
ELEC3: U1.41(ELEC3)
ELEC4: U1.40(ELEC4)
ELEC5: U1.39(ELEC5)
ELEC6: U1.38(ELEC6)
ELEC7: U1.37(ELEC7)
ELEC8: U1.36(ELEC8)
ELEC9: U1.35(ELEC9)
ELEC10: U1.34(ELEC10)
ELEC11: U1.33(ELEC11)
ELEC12: U1.32(ELEC12)
ELEC13: U1.31(ELEC13)
ELEC14: U1.30(ELEC14)
ELEC15: U1.29(ELEC15)
LVDS_Enable: R7.1 U1.26(LVDS_EN)
MISO_N: U1.20(MISO-) ; port MISO_N
MISO_P: U1.21(MISO+) ; port MISO_P
MOSI_N: U1.18(MOSI-) ; port MOSI_N
MOSI_P: U1.19(MOSI+) ; port MOSI_P
nCS_N: U1.14(!CS!-) ; port nCS_N
nCS_P: U1.15(!CS!+) ; port nCS_P
SCLK_N: U1.16(SCLK-) ; port SCLK_N
SCLK_P: U1.17(SCLK+) ; port SCLK_P
NetC2_2: C2.2 U1.23(ADC_REF)

Not connected (* = marked no-connect by the designer): U1 10(AUXOUT1) 11(AUXOUT2) 12(AUXOUTOD)

### Channels
A1: designators end in _A1; ports MISO_N=MISO1h_N MISO_P=MISO1h_P MOSI_N=MOSI1h_N MOSI_P=MOSI1h_P nCS_N=nCS1h_N nCS_P=nCS1h_P SCLK_N=SCLK1h_N SCLK_P=SCLK1h_P
A2: designators end in _A2; ports MISO_N=MISO2h_N MISO_P=MISO2h_P MOSI_N=MOSI2h_N MOSI_P=MOSI2h_P nCS_N=nCS2h_N nCS_P=nCS2h_P SCLK_N=SCLK2h_N SCLK_P=SCLK2h_P
A3: designators end in _A3; ports MISO_N=MISO3h_N MISO_P=MISO3h_P MOSI_N=MOSI3h_N MOSI_P=MOSI3h_P nCS_N=nCS1h_N nCS_P=nCS1h_P SCLK_N=SCLK1h_N SCLK_P=SCLK1h_P
A4: designators end in _A4; ports MISO_N=MISO4h_N MISO_P=MISO4h_P MOSI_N=MOSI4h_N MOSI_P=MOSI4h_P nCS_N=nCS2h_N nCS_P=nCS2h_P SCLK_N=SCLK2h_N SCLK_P=SCLK2h_P

### Buses and harness runs
bus ELEC[0..15] = port ELEC[0..15]

### Layout directives
differential pair: MISO1h_N, MISO1h_P, MOSI1h_N, MOSI1h_P, nCS1h_N, nCS1h_P, SCLK1h_N, SCLK1h_P

### Notes on the sheet
- Add 100Ohm termination resistors in parent schematic to avoid duplicates

### Library data of the parts
C1 C4 = capacitor_npol_ame: as C13 on sheet MEA_CLDP; Package: 0402; Supplier 1: Digikey; Supplier Part Number 1: 311-2077-1-ND; Supplier Link 1: https://www.digikey.ca/product-detail/en/yageo/CC0402KRX7R8BB104/311-2077-1-ND/5698948; Stock 1: 143,749; ComponentLink1URL: http://www.yageo.com/documents/recent/UPY-GPHC_X7R_6.3V-to-50V_18.pdf; ComponentLink1Description: Datasheet; Supplier Description 1: CAP CER 0.1UF 25V X7R 0402
C2 = capacitor_npol_ame_10n: Capacitor Non-polarized American Symbol; Manufacturer: Murata Electronics North America; Manufacturer Part Number: GRM155R71H103KA88D; Tolerance: 10%; Voltage Rating: 25V; Case Code: 0402; ComponentLink1Description: Reference Sheet; ComponentLink1URL: https://www.murata.com/~/media/webrenewal/support/library/catalog/products/capacitor/mlcc/c02e.ashx?la=en-us; Pricing 1: Free; Stock 1: 8970712; Supplier 1: 7PCB/Bittele; Supplier Description 1: CAP CER 0.01uF ±10% 50V X7R 0402; Supplier Link 1: https://parts.7pcb.com/; Supplier Part Number 1: GRM155R71H103KA88D
C3 = capacitor_npol_ame: Capacitor Non-polarized American Symbol; Manufacturer: Yageo; Manufacturer PN: CC0402KRX7R8BB104; Voltage Rating: 25V; Priging 1: 1 	0.15000 	$0.15 (CAD); Package: 0402; Supplier 1: Digikey; Supplier Part Number 1: 311-2077-1-ND; Supplier Link 1: https://www.digikey.ca/product-detail/en/yageo/CC0402KRX7R8BB104/311-2077-1-ND/5698948; Stock 1: 143,749; ComponentLink1URL: http://www.yageo.com/documents/recent/UPY-GPHC_X7R_6.3V-to-50V_18.pdf; ComponentLink1Description: Datasheet; Supplier Description 1: CAP CER 0.1UF 25V X7R 0402; Manufacturer Part Number: CC0402KRX7R8BB104
R7 R20 = RES100: as R25 on sheet MEA_CLDP; Supplier 1: 7PCB/Bittle; Stock 1: 1271266; Pricing 1: Free; Case/Package: 0402; Case Code (Metric): 1005; Case Code (Imperial): 0402; Min Operating Temperature: -55°C; Max Operating Temperature: 155°C; Packaging: Paper Tape; Composition: Thick Film; Package Quantity: 1; Number of Terminations: 2; Termination: SMD/SMT; Military Standard: Not; Max Power Dissipation: 0.063W; REACH SVHC: Unknown; Lead Free: Lead Free; ComponentLink1URL: http://www.vishay.com/docs/20035/dcrcwe3.pdf; ComponentLink1Description: Datasheet 1; Supplier Part Number 1: CRCW04020000Z0ED; Length: 1mm; Width: 0.5mm; Supplier Link 1: https://parts.7pcb.com/; Supplier Description 1: RES SMD 0.0OHM JUMPER 1/16W 0402; Height: 0.4mm
U1 = RHS2116_QFN: ComponentLink1Discription: Datasheet; ComponentLink2Discription: Bare Die; Pricing 1: 1-24=325;  25-99=278;  100-249=233;  250-499=188;  500-999=151  (USD); Supplier 1: Intan; Manufacturer: Intan Technologies; Manufacturer Part Number: RHS2116; Supplier Part Number 1: RHS2116; ComponentLink1URL: http://intantech.com/files/Intan_RHS2116_datasheet.pdf; ComponentLink2URL: http://intantech.com/files/RHS2116_die_diagram.pdf; Supplier Link 1: http://intantech.com/products_RHS2000.html

## Sheet hdmi_to_8pin_header.SchDoc
size A4
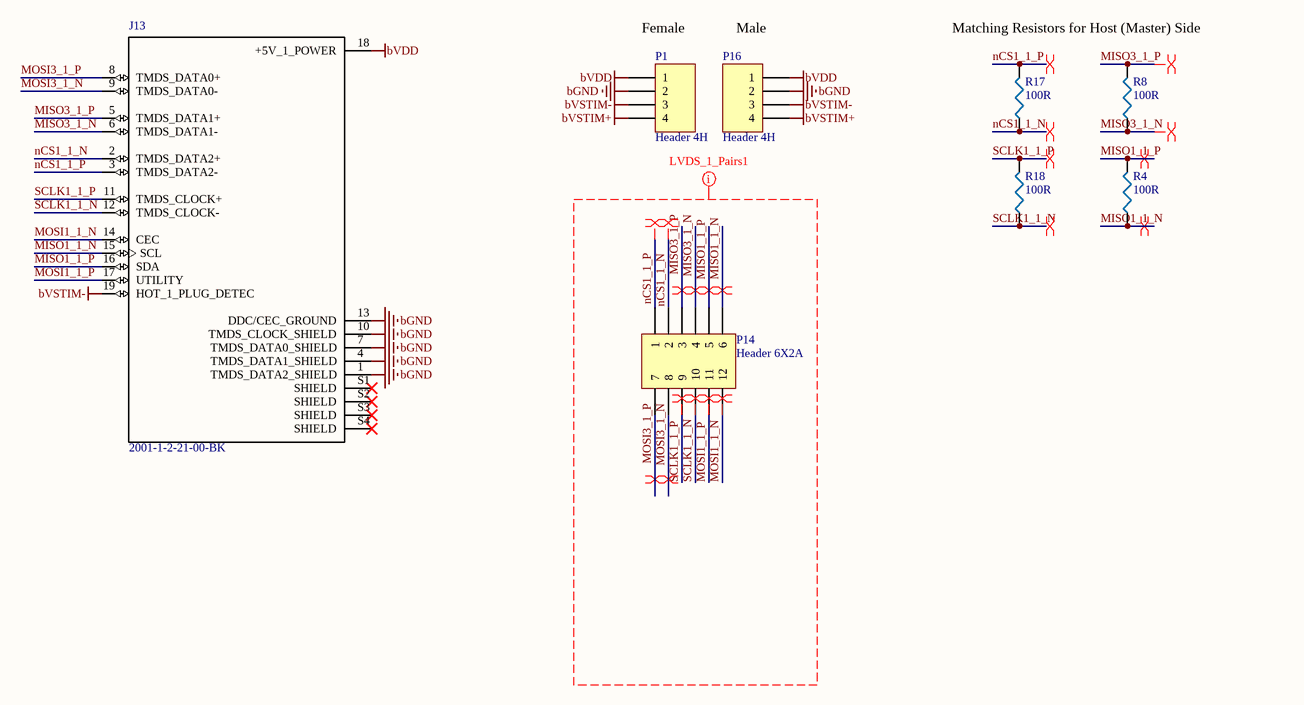
[diagram p3: hdmi_to_8pin_header.SchDoc]

### Parts
J13  2001-1-2-21-00-BK  [*CNC_2001-1-2-21-00-BK_2001-1-2-21-00-BK(Primary)]
P1  Header 4H  [PPTC041LGBN-RC]
P14  Header 6X2A  [PPPC062LJBN-RC]
P16  Header 4H  [PEC04SBAN]
R4  100R  [R0805]
R8  100R  [R0805]
R17  100R  [R0805]
R18  100R  [R0805]

### Nets
bGND: J13.1(TMDS_DATA2_SHIELD) J13.4(TMDS_DATA1_SHIELD) J13.7(TMDS_DATA0_SHIELD) J13.10(TMDS_CLOCK_SHIELD) J13.13(DDC/CEC_GROUND) P1.2 P16.2
bVDD: J13.18(+5V_1_POWER) P1.1 P16.1
bVSTIM+: P1.4 P16.4
bVSTIM-: J13.19(HOT_1_PLUG_DETEC) P1.3 P16.3
MISO1_1_N: J13.15(SCL) P14.6 R4.1
MISO1_1_P: J13.16(SDA) P14.5 R4.2
MISO3_1_N: J13.6(TMDS_DATA1-) P14.4 R8.1
MISO3_1_P: J13.5(TMDS_DATA1+) P14.3 R8.2
MOSI1_1_N: J13.14(CEC) P14.12
MOSI1_1_P: J13.17(UTILITY) P14.11
MOSI3_1_N: J13.9(TMDS_DATA0-) P14.8
MOSI3_1_P: J13.8(TMDS_DATA0+) P14.7
nCS1_1_N: J13.2(TMDS_DATA2+) P14.2 R17.1
nCS1_1_P: J13.3(TMDS_DATA2-) P14.1 R17.2
SCLK1_1_N: J13.12(TMDS_CLOCK-) P14.10 R18.1
SCLK1_1_P: J13.11(TMDS_CLOCK+) P14.9 R18.2

Not connected (* = marked no-connect by the designer): J13 S1(SHIELD)* S2(SHIELD)* S3(SHIELD)* S4(SHIELD)*

### Layout directives
differential pair: MISO1_1_N, MISO1_1_P, MISO3_1_N, MISO3_1_P, MOSI1_1_N, MOSI1_1_P, MOSI3_1_N, MOSI3_1_P, nCS1_1_N, nCS1_1_P, SCLK1_1_N, SCLK1_1_P
net class LVDS_1_Pairs1: MISO1_1_N, MISO1_1_P, MISO3_1_N, MISO3_1_P, MOSI1_1_N, MOSI1_1_P, MOSI3_1_N, MOSI3_1_P, nCS1_1_N, nCS1_1_P, SCLK1_1_N, SCLK1_1_P

### Notes on the sheet
- (near P1) Female
- (near P16) Male
- Matching Resistors for Host (Master) Side

### Library data of the parts
J13 = 2001-1-2-21-00-BK: Mini Hdmi 19p Female Smt; Manufacturer: CNC Tech; Pricing1: Price Break  Unit Price  Extended Price  1  2.69000  $2.69  10  2.43900  $24.39  25  2.28960  $57.24  50  2.19000  $109.50  100  2.09050  $209.05  250  1.89140  $472.85  500  1.74208  $871.04 (CAD); Digi-Key_Part_Number: 1175-1704-1-ND; Digi-Key_Purchase_URL: https://www.digikey.com/product-detail/en/cnc-tech/2001-1-2-21-00-BK/1175-1704-1-ND/4867013?utm_source=snapeda&utm_medium=aggregator&utm_campaign=symbol; Manufacturer Part Number: 2001-1-2-21-00-BK; SnapEDA_Link: https://www.snapeda.com/parts/2001-1-2-21-00-BK/CNC%20Tech/view-part/?ref=snap; Supplier 1: Digikey; Supplier Part Number 1: 1175-1704-1-ND; Supplier Link 1: https://www.digikey.ca/product-detail/en/cnc-tech/2001-1-2-21-00-BK/1175-1704-1-ND/4867013; Stock1: 3,276; ComponentLink1URL: http://cnctech.us/pdfs/2001-1-2-21-00-BK.pdf; ComponentLink1Description: Datasheet
P1 = Header 4H: Header, 4-Pin, Right Angle; Manufacturer: Sullins Connector Solutions; Pricing1: Price Break  Unit Price  Extended Price  1  0.79000  $0.79  10  0.73700  $7.37  100  0.56490  $56.49  500  0.49124  $245.62  1,000  0.40528  $405.28  5,000  0.35615  $1,780.73  10,000  0.35478  $3,547.80 (CAD); Detailed Description: 4 Position Header Connector 0.100" (2.54mm) Through Hole, Right Angle Tin; LatestRevisionDate: 17-Jul-2002; LatestRevisionNote: Re-released for DXP Platform.; Publisher: Altium Limited; Manufacturer Part Number: PPTC041LGBN-RC; Manufacturer Link: https://www.sullinscorp.com/product/?pn=PPTC041LGBN-RC&toggle=in; Supplier 1: Digikey; Supplier Part Number 1: S5440-ND; Supplier Link 1: https://www.digikey.ca/product-detail/en/sullins-connector-solutions/PPTC041LGBN-RC/S5440-ND/775898; Stock1: 12,644; ComponentLink1URL: https://drawings-pdf.s3.amazonaws.com/10493.pdf; ComponentLink1Description: Datasheet
P14 = Header 6X2A: Header, 6-Pin, Dual row; Manufacturer: Sullins Connector Solutions; Pricing1: 1  1.80000  $1.80  10  1.57700  $15.77  100  1.36070  $136.07  500  1.11330  $556.65  1,000  0.98959  $989.59  5,000  0.89338  $4,466.92 (CAD); LatestRevisionDate: 17-Jul-2002; LatestRevisionNote: Re-released for DXP Platform.; Publisher: Altium Limited; Manufacturer Part Number: PPPC062LJBN-RC; Manufacturer Link: https://www.sullinscorp.com/product/?pn=PPPC062LJBN-RC&toggle=in; Supplier 1: Digikey; Supplier Link 1: https://www.digikey.ca/product-detail/en/sullins-connector-solutions/PPPC062LJBN-RC/S5559-ND/776017; Supplier Part Number 1: S5559-ND; Stock1: 7,855; ComponentLink1URL: https://drawings-pdf.s3.amazonaws.com/10494.pdf; ComponentLink1Description: Datasheet
P16 = Header 4H: Header, 4-Pin, Right Angle; Manufacturer: Sullins Connector Solutions; pricing1: Price Break  Unit Price  Extended Price  1  0.54000  $0.54  10  0.50800  $5.08  25  0.43560  $10.89  50  0.37020  $18.51  100  0.35560  $35.56  250  0.31940  $79.85  500  0.30486  $152.43 (CAD); LatestRevisionDate: 17-Jul-2002; LatestRevisionNote: Re-released for DXP Platform.; Publisher: Altium Limited; Manufacturer Part Number: PEC04SBAN; Manufacturer Link: https://www.sullinscorp.com/product/?pn=PPPC181LFBN-RC&toggle=in#; Supplier 1: Digikey; Supplier Part Number 1: S1112E-04-ND; Supplier Link 1: https://www.digikey.ca/product-detail/en/sullins-connector-solutions/PEC04SBAN/S1112E-04-ND/860093; Stock1: 2,184; ComponentLink1URL: https://drawings-pdf.s3.amazonaws.com/10492.pdf; ComponentLink1Description: Datasheet
R4 R8 R17 R18 = RES100: ERJ-6ENF1000V; Manufacturer: Panasonic Electronic Components; Tolerance: 1%; Temperature Coefficient: 100ppm/°C; Power Rating: 125mW; Voltage Rating: 150V; Supplier 1: Digi-Key; Manufacturer Part Number: ERJ-6ENF1000V; Stock 1: 1859281; Pricing 1: 1=0.16;  10=0.15;  100=0.05760;  1000=0.02535;  2500=0.02190  (CAD); Case/Package: 0805; Case Code (Metric): 2012; Case Code (Imperial): 0805; Min Operating Temperature: -55°C; Max Operating Temperature: 155°C; Resistance: 100R; Packaging: Paper Tape; Composition: Thick Film; Package Quantity: 1; Number of Terminations: 2; Termination: SMD/SMT; Military Standard: Not; Max Power Dissipation: 125mW; REACH SVHC: Unknown; Lead Free: Lead Free; ComponentLink1URL: https://industrial.panasonic.com/cdbs/www-data/pdf/RDA0000/AOA0000C304.pdf; ComponentLink1Description: Datasheet; ComponentLink2URL: https://industrial.panasonic.com/ww/products/resistors/chip-resistors/general-purpose-chip-resistors/precision-thick-film-chip-resistors/ERJ6ENF1000V; ComponentLink2Description: Specifications; Supplier Part Number 1: P100CCT-ND; Weight: 4mg; Length: 2mm; Width: 1.25mm; Supplier Link 1: https://www.digikey.ca/product-detail/en/panasonic-electronic-components/ERJ-6ENF1000V/P100CCT-ND/118668

## Sheet UNIT_V3_LVDS_Board.SchDoc
size 635 x 254 mm
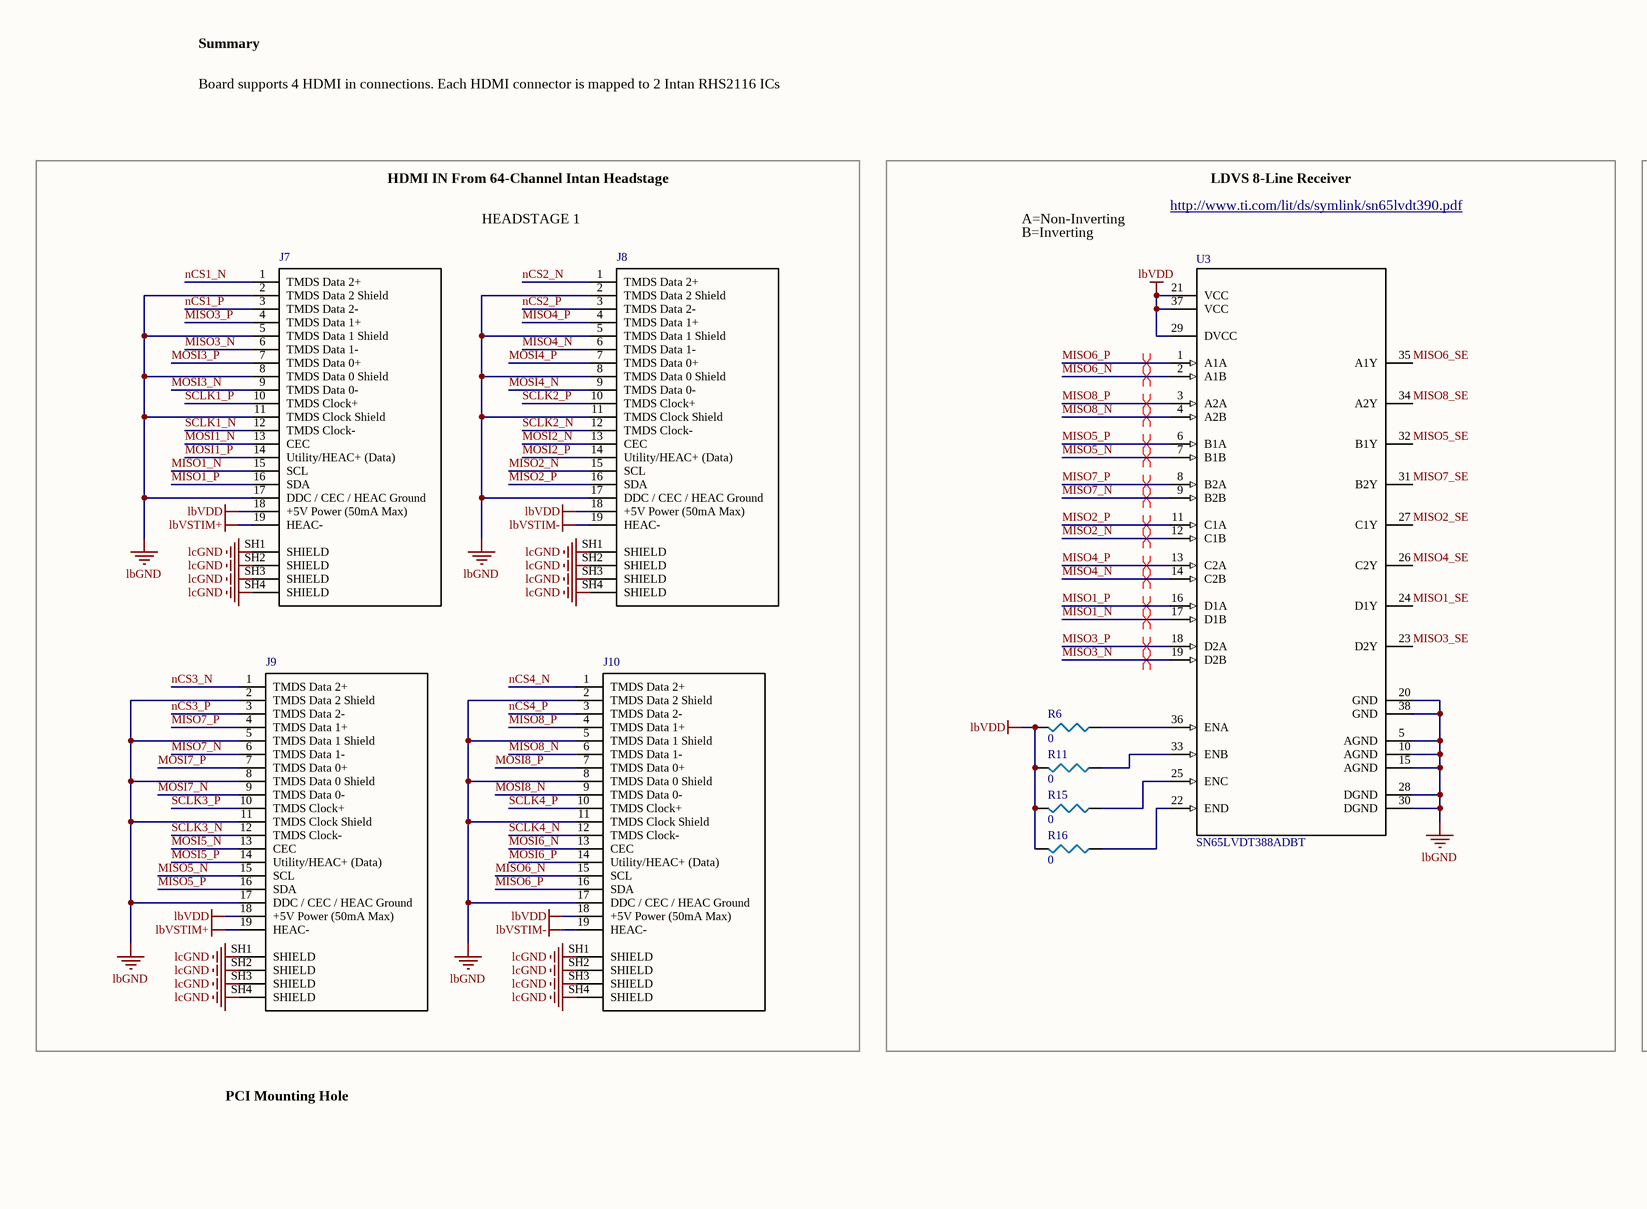
[diagram p4: UNIT_V3_LVDS_Board.SchDoc, left]
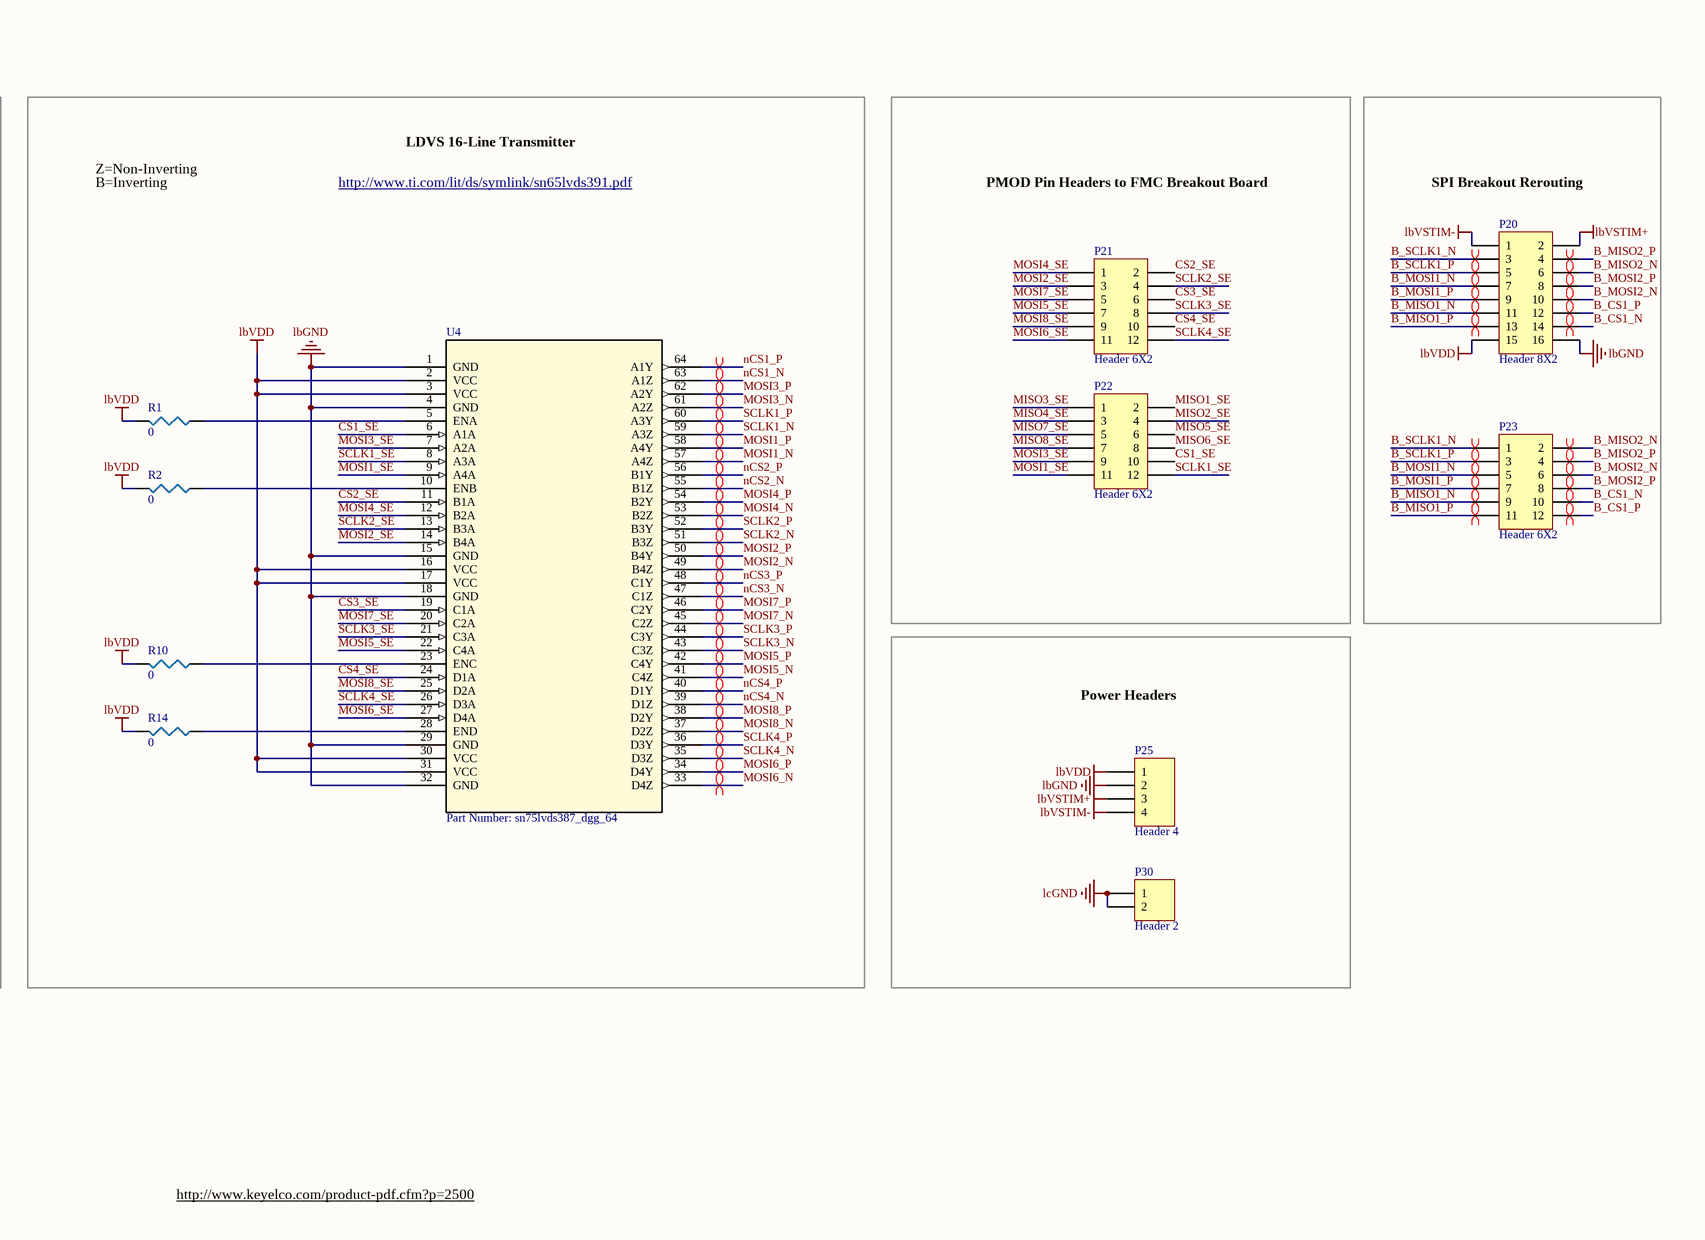
[diagram p5: UNIT_V3_LVDS_Board.SchDoc, right]

### Parts
J7  1747981-2  [TE_1747981-2_1747981-2(Primary)]  (value not drawn)
J8  1747981-2  [TE_1747981-2_1747981-2(Primary)]  (value not drawn)
J9  1747981-2  [TE_1747981-2_1747981-2(Primary)]  (value not drawn)
J10  1747981-2  [TE_1747981-2_1747981-2(Primary)]  (value not drawn)
P20  Header 8X2  [TE_534998-8]
P21  Header 6X2  [0010897120]
P22  Header 6X2  [0010897120]
P23  Header 6X2  [0010897120]
P25  Header 4  [OSTVN04A150]
P30  Header 2  [OSTVN02A150]
R1  0  [R0805]
R2  0  [R0805]
R6  0  [R0805]
R10  0  [R0805]
R11  0  [R0805]
R14  0  [R0805]
R15  0  [R0805]
R16  0  [R0805]
U3  SN65LVDT388ADBT  [DBT0038A_N]
U4  Part Number: sn75lvds387_dgg_64  [DGG64]

### Blocks framed on the sheet
PMOD Pin Headers to FMC Breakout Board: P21 P22
SPI Breakout Rerouting: P20 P23
Power Headers: P25 P30

### Nets
lbGND: J7.2(TMDS_Data_2_Shield) J7.5(TMDS_Data_1_Shield) J7.8(TMDS_Data_0_Shield) J7.11(TMDS_Clock_Shield) J7.17(DDC_/_CEC_/_HEAC_Ground) J8.2(TMDS_Data_2_Shield) J8.5(TMDS_Data_1_Shield) J8.8(TMDS_Data_0_Shield) J8.11(TMDS_Clock_Shield) J8.17(DDC_/_CEC_/_HEAC_Ground) J9.2(TMDS_Data_2_Shield) J9.5(TMDS_Data_1_Shield) J9.8(TMDS_Data_0_Shield) J9.11(TMDS_Clock_Shield) J9.17(DDC_/_CEC_/_HEAC_Ground) J10.2(TMDS_Data_2_Shield) J10.5(TMDS_Data_1_Shield) J10.8(TMDS_Data_0_Shield) J10.11(TMDS_Clock_Shield) J10.17(DDC_/_CEC_/_HEAC_Ground) P20.16 P25.2 U3.5(AGND) U3.10(AGND) U3.15(AGND) U3.20(GND) U3.28(DGND) U3.30(DGND) U3.38(GND) U4.1(GND) U4.4(GND) U4.15(GND) U4.18(GND) U4.29(GND) U4.32(GND)
lbVDD: J7.18(+5V_Power_(50mA_Max)) J8.18(+5V_Power_(50mA_Max)) J9.18(+5V_Power_(50mA_Max)) J10.18(+5V_Power_(50mA_Max)) P20.15 P25.1 R1.2 R2.2 R6.2 R10.2 R11.2 R14.2 R15.2 R16.2 U3.21(VCC) U3.29(DVCC) U3.37(VCC) U4.2(VCC) U4.3(VCC) U4.16(VCC) U4.17(VCC) U4.30(VCC) U4.31(VCC)
lbVSTIM+: J7.19(HEAC-) J9.19(HEAC-) P20.2 P25.3
lbVSTIM-: J8.19(HEAC-) J10.19(HEAC-) P20.1 P25.4
lcGND: J7.SH1(SHIELD) J7.SH2(SHIELD) J7.SH3(SHIELD) J7.SH4(SHIELD) J8.SH1(SHIELD) J8.SH2(SHIELD) J8.SH3(SHIELD) J8.SH4(SHIELD) J9.SH1(SHIELD) J9.SH2(SHIELD) J9.SH3(SHIELD) J9.SH4(SHIELD) J10.SH1(SHIELD) J10.SH2(SHIELD) J10.SH3(SHIELD) J10.SH4(SHIELD) P30.1 P30.2
B_CS1_N: P20.14 P23.10
B_CS1_P: P20.12 P23.12
B_MISO1_N: P20.11 P23.9
B_MISO1_P: P20.13 P23.11
B_MISO2_N: P20.6 P23.2
B_MISO2_P: P20.4 P23.4
B_MOSI1_N: P20.7 P23.5
B_MOSI1_P: P20.9 P23.7
B_MOSI2_N: P20.10 P23.6
B_MOSI2_P: P20.8 P23.8
B_SCLK1_N: P20.3 P23.1
B_SCLK1_P: P20.5 P23.3
CS1_SE: P22.10 U4.6(A1A)
CS2_SE: P21.2 U4.11(B1A)
CS3_SE: P21.6 U4.19(C1A)
CS4_SE: P21.10 U4.24(D1A)
MISO1_N: J7.15(SCL) U3.17(D1B)
MISO1_P: J7.16(SDA) U3.16(D1A)
MISO1_SE: P22.2 U3.24(D1Y)
MISO2_N: J8.15(SCL) U3.12(C1B)
MISO2_P: J8.16(SDA) U3.11(C1A)
MISO2_SE: P22.4 U3.27(C1Y)
MISO3_N: J7.6(TMDS_Data_1-) U3.19(D2B)
MISO3_P: J7.4(TMDS_Data_1+) U3.18(D2A)
MISO3_SE: P22.1 U3.23(D2Y)
MISO4_N: J8.6(TMDS_Data_1-) U3.14(C2B)
MISO4_P: J8.4(TMDS_Data_1+) U3.13(C2A)
MISO4_SE: P22.3 U3.26(C2Y)
MISO5_N: J9.15(SCL) U3.7(B1B)
MISO5_P: J9.16(SDA) U3.6(B1A)
MISO5_SE: P22.6 U3.32(B1Y)
MISO6_N: J10.15(SCL) U3.2(A1B)
MISO6_P: J10.16(SDA) U3.1(A1A)
MISO6_SE: P22.8 U3.35(A1Y)
MISO7_N: J9.6(TMDS_Data_1-) U3.9(B2B)
MISO7_P: J9.4(TMDS_Data_1+) U3.8(B2A)
MISO7_SE: P22.5 U3.31(B2Y)
MISO8_N: J10.6(TMDS_Data_1-) U3.4(A2B)
MISO8_P: J10.4(TMDS_Data_1+) U3.3(A2A)
MISO8_SE: P22.7 U3.34(A2Y)
MOSI1_N: J7.13(CEC) U4.57(A4Z)
MOSI1_P: J7.14(Utility/HEAC+_(Data)) U4.58(A4Y)
MOSI1_SE: P22.11 U4.9(A4A)
MOSI2_N: J8.13(CEC) U4.49(B4Z)
MOSI2_P: J8.14(Utility/HEAC+_(Data)) U4.50(B4Y)
MOSI2_SE: P21.3 U4.14(B4A)
MOSI3_N: J7.9(TMDS_Data_0-) U4.61(A2Z)
MOSI3_P: J7.7(TMDS_Data_0+) U4.62(A2Y)
MOSI3_SE: P22.9 U4.7(A2A)
MOSI4_N: J8.9(TMDS_Data_0-) U4.53(B2Z)
MOSI4_P: J8.7(TMDS_Data_0+) U4.54(B2Y)
MOSI4_SE: P21.1 U4.12(B2A)
MOSI5_N: J9.13(CEC) U4.41(C4Z)
MOSI5_P: J9.14(Utility/HEAC+_(Data)) U4.42(C4Y)
MOSI5_SE: P21.7 U4.22(C4A)
MOSI6_N: J10.13(CEC) U4.33(D4Z)
MOSI6_P: J10.14(Utility/HEAC+_(Data)) U4.34(D4Y)
MOSI6_SE: P21.11 U4.27(D4A)
MOSI7_N: J9.9(TMDS_Data_0-) U4.45(C2Z)
MOSI7_P: J9.7(TMDS_Data_0+) U4.46(C2Y)
MOSI7_SE: P21.5 U4.20(C2A)
MOSI8_N: J10.9(TMDS_Data_0-) U4.37(D2Z)
MOSI8_P: J10.7(TMDS_Data_0+) U4.38(D2Y)
MOSI8_SE: P21.9 U4.25(D2A)
nCS1_N: J7.1(TMDS_Data_2+) U4.63(A1Z)
nCS1_P: J7.3(TMDS_Data_2-) U4.64(A1Y)
nCS2_N: J8.1(TMDS_Data_2+) U4.55(B1Z)
nCS2_P: J8.3(TMDS_Data_2-) U4.56(B1Y)
nCS3_N: J9.1(TMDS_Data_2+) U4.47(C1Z)
nCS3_P: J9.3(TMDS_Data_2-) U4.48(C1Y)
nCS4_N: J10.1(TMDS_Data_2+) U4.39(D1Z)
nCS4_P: J10.3(TMDS_Data_2-) U4.40(D1Y)
SCLK1_N: J7.12(TMDS_Clock-) U4.59(A3Z)
SCLK1_P: J7.10(TMDS_Clock+) U4.60(A3Y)
SCLK1_SE: P22.12 U4.8(A3A)
SCLK2_N: J8.12(TMDS_Clock-) U4.51(B3Z)
SCLK2_P: J8.10(TMDS_Clock+) U4.52(B3Y)
SCLK2_SE: P21.4 U4.13(B3A)
SCLK3_N: J9.12(TMDS_Clock-) U4.43(C3Z)
SCLK3_P: J9.10(TMDS_Clock+) U4.44(C3Y)
SCLK3_SE: P21.8 U4.21(C3A)
SCLK4_N: J10.12(TMDS_Clock-) U4.35(D3Z)
SCLK4_P: J10.10(TMDS_Clock+) U4.36(D3Y)
SCLK4_SE: P21.12 U4.26(D3A)
NetR1_1: R1.1 U4.5(ENA)
NetR2_1: R2.1 U4.10(ENB)
NetR6_1: R6.1 U3.36(ENA)
NetR10_1: R10.1 U4.23(ENC)
NetR11_1: R11.1 U3.33(ENB)
NetR14_1: R14.1 U4.28(END)
NetR15_1: R15.1 U3.25(ENC)
NetR16_1: R16.1 U3.22(END)

### Layout directives
differential pair: (no net found under the mark), B_MISO1_N, B_MISO1_P, B_MOSI1_N, B_MOSI1_P, B_SCLK1_N, B_SCLK1_P, MISO1_N, MISO1_P, MISO2_N, MISO2_P, MISO3_N, MISO3_P, MISO4_N, MISO4_P, MISO5_N, MISO5_P, MISO6_N, MISO6_P, MISO7_N, MISO7_P, MISO8_N, MISO8_P, MOSI1_N, MOSI1_P, MOSI2_N, MOSI2_P, MOSI3_N, MOSI3_P, MOSI4_N, MOSI4_P, MOSI5_N, MOSI5_P, MOSI6_N, MOSI6_P, MOSI7_N, MOSI7_P, MOSI8_N, MOSI8_P, nCS1_N, nCS1_P, nCS2_N, nCS2_P, nCS3_N, nCS3_P, nCS4_N, nCS4_P, SCLK1_N, SCLK1_P, SCLK2_N, SCLK2_P, SCLK3_N, SCLK3_P, SCLK4_N, SCLK4_P

### Notes on the sheet
- Summary
- Board supports 4 HDMI in connections. Each HDMI connector is mapped to 2 Intan RHS2116 ICs
- HDMI IN From 64-Channel Intan Headstage
- LDVS 8-Line Receiver
- HEADSTAGE 1
- A=Non-Inverting
- B=Inverting
- http://www.ti.com/lit/ds/symlink/sn65lvdt390.pdf
- Z=Non-Inverting
- http://www.ti.com/lit/ds/symlink/sn65lvds391.pdf
- LDVS 16-Line Transmitter
- PCI Mounting Hole
- http://www.keyelco.com/product-pdf.cfm?p=2500

### Library data of the parts
J7-J10 = 1747981-2: as J2 on sheet MEA_CLDP; TE_purchase_URL: https://www.te.com/usa-en/product-1747981-2.html?te_bu=Cor&te_type=disp&te_campaign=seda_glo_cor-seda-global-disp-prtnr-fy19-seda-model-bom-cta_sma-317_1&elqCampaignId=32493; SnapEDA_Link: https://www.snapeda.com/parts/1747981-2/TE%20Connectivity%20AMP%20Connectors/view-part/?ref=snap; Package: None; MP: 1747981-2; EU_RoHS_Compliance: Compliant; Availability: Unavailable; Price: None; Value: *; ComponentLink1Description: Datasheet; ComponentLink1URL: https://www.te.com/commerce/DocumentDelivery/DDEController?Action=srchrtrv&DocNm=1747981&DocType=Customer+Drawing&DocLang=English; Manufacturer: TE Connectivity; Manufacturer Part Number: 1747981-2; Stock1: 1,426; Supplier 1: Digikey; Supplier Link 1: https://www.digikey.ca/product-detail/en/te-connectivity-amp-connectors/1747981-2/A130924CT-ND/8602669; Supplier Part Number 1: A130924CT-ND
P20 = Header 8X2: Header, 8-Pin, Dual row; Manufacturer: TE Connectivity; Manufacturer Part Number: 534998-8; Pricing1: 1  5.59000  $5.59  28  4.92321  $137.85  112  4.47580  $501.29  504  3.80446  $1,917.45  1,008  3.24498  $3,270.94 (CAD); LatestRevisionDate: 17-Jul-2002; LatestRevisionNote: Re-released for DXP Platform.; Publisher: Altium Limited; ComponentLink1Description: Datasheet; ComponentLink1URL: https://www.te.com/commerce/DocumentDelivery/DDEController?Action=srchrtrv&DocNm=534998&DocType=Customer+Drawing&DocLang=English; Stock1: 13,776; Supplier 1: Digikey; Supplier Link 1: https://www.digikey.ca/product-detail/en/te-connectivity-amp-connectors/534998-8/A26489-ND/298054; Supplier Part Number 1: A26489-ND
P21-P23 = Header 6X2: Header, 6-Pin, Dual row; Manufacturer: Molex; Pricing1: 1  1.65000  $1.65 (CAD); LatestRevisionDate: 17-Jul-2002; LatestRevisionNote: Re-released for DXP Platform.; ComponentLink1Description: Datasheet; ComponentLink1URL: https://www.molex.com/pdm_docs/sd/010897120_sd.pdf; Manufacturer Part Number: 0010897120; Manufacturer Link: https://www.molex.com/molex/products/datasheet.jsp?part=active/0010897120_PCB_HEADERS.xml; Supplier 1: Digikey; Supplier Part Number 1: WM13108-ND; Supplier Link 1: https://www.digikey.com/product-detail/en/molex/0010897120/WM13108-ND/3068090; Stock1: 2,645
  P22 P23: Publisher: Altium Limited
P25 = Header 4: as P17 on sheet MEA_CLDP; LatestRevisionDate: 17-Jul-2002; LatestRevisionNote: Re-released for DXP Platform.; Publisher: Altium Limited; Manufacturer Part Number: OSTVN04A150; Manufacturer Link: https://www.on-shore.com/part/ostvnxxa150-terminal-block-one-piece-rising-clamp/; Supplier 1: Digikey; Supplier Link 1: https://www.digikey.com/product-detail/en/on-shore-technology-inc/OSTVN04A150/ED10563-ND/1588864; Supplier Part Number 1: ED10563-ND; Pricing 1: 1  1.38000  $1.38  10  0.96900  $9.69  25  0.90400  $22.60  50  0.82040  $41.02  100  0.81680  $81.68  250  0.68972  $172.43  500  0.65340  $326.70  1,000  0.58080  $580.80  5,000  0.47190  $2,359.50 (CAD); Stock 1: 8,195; ComponentLink1URL: http://www.on-shore.com/wp-content/uploads/OSTVNXXA150.pdf; ComponentLink1Description: Datasheet
P30 = Header 2: Header, 2-Pin; Manufacturer: On Shore Technology Inc.; Pricing1: 1  1.29000  $1.29 (CAD); LatestRevisionDate: 17-Jul-2002; LatestRevisionNote: Re-released for DXP Platform.; Publisher: Altium Limited; Manufacturer Part Number: OSTVN02A150; Manufacturer Link: https://www.on-shore.com/part/ostvnxxa150-terminal-block-one-piece-rising-clamp/; Supplier 1: Digikey; Supplier Part Number 1: ED10561-ND; Supplier Link 1: https://www.digikey.ca/product-detail/en/on-shore-technology-inc/OSTVN02A150/ED10561-ND/1588862; Stock1: 21,116
R1 R2 R6 R10 R11 R14-R16 = RES0: RC0805JR-070RL; Manufacturer: Yageo; Tolerance: 1%; Resistance: 0R; Temperature Coefficient: 100ppm/°C; Power Rating: 125mW; Voltage Rating: 150V; Supplier 1: Digi-Key; Manufacturer Part Number: RC0805JR-070RL; Stock 1: 3924855; Pricing 1: 1=0.15;  10=0.055;  25=0.0408;  50=0.0308;  100=0.0229;  250=0.01740;  500=0.0139;  1000=0.01024 (CAD); Case/Package: 0805; Case Code (Metric): 2012; Case Code (Imperial): 0805; Min Operating Temperature: -55°C; Max Operating Temperature: 155°C; Packaging: Tape and Reel; Composition: Thick Film; Package Quantity: 1; Number of Terminations: 2; Termination: SMD/SMT; Military Standard: Not; Max Power Dissipation: 125mW; Length: 2mm; Depth: 1.25mm; REACH SVHC: Unknown; Lead Free: Lead Free; Supplier Part Number 1: 311-0.0ARCT-ND; Supplier Link 1: https://www.digikey.ca/product-detail/en/yageo/RC0805JR-070RL/311-0.0ARCT-ND/731163
U3 = SN65LVDT388ADBTR: IC OCTAL LVDS RECEIVER 38-TSSOP; Manufacturer: Texas Instruments; Pricing1: Price Break  Unit Price  Extended Price  1  6.13000  $6.13  10  5.51000  $55.10  50  5.20880  $260.44  100  4.51430  $451.43  500  3.84290  $1,921.45  1,000  3.24100  $3,241.00  2,500  3.07895  $7,697.38 (CAD); PartNumber: SN65LVDT388ADBTR; RefDes: RefDes; Type: DEV; Value: Value; Copyright: Copyright (C) 2018 Accelerated Designs. All rights reserved; Manufacturer Part Number: SN65LVDT388ADBT; Manufacturer Link: http://www.ti.com/product/SN65LVDT388A?keyMatch=SN65LVDT388A&tisearch=Search-EN-Products; Supplier 1: Digikey; Supplier Part Number 1: 296-6899-5-ND; Supplier Link 1: https://www.digikey.com/products/en?mpart=SN65LVDT388ADBT&v=296; Stock1: 5,642
U4 = SN75LVDS387_DGG_64: 16-Channel LVDS Transmitter; Manufacturer: Texas Instruments; Manufacturer Part Number: SN75LVDS387DGG; INDUSTRY_STD_PKG_TYPE: TSSOP; FAMILY_NAME: LVDS PHY (<800MBPS); PIN_COUNT: 64; PACKAGE_DESIGNATOR: DGG; Pricing1: Price Break  Unit Price  Extended Price  1  11.73000  $11.73  10  10.59500  $105.95  25  10.10240  $252.56  100  8.77180  $877.18  500  7.63840  $3,819.20  1,000  6.65280  $6,652.80 (CAD); Datasheet_URL: http://www.ti.com/lit/gpn/SN75LVDS387; GENERIC_PART_NUMBER: SN75LVDS387; Vendor: Texas Instruments; Manufacturer_Part_Number: sn75lvds387_dgg_64; Copyright: Copyright (C) 2018 Accelerated Designs. All rights reserved; RefDes: RefDes; Type: DEV; Value: Value; Manufacturer Link: http://www.ti.com/product/SN75LVDS387; Supplier 1: Digikey; Supplier Part Number 1: 296-2367-5-ND; Supplier Link 1: https://www.digikey.com/products/en?mpart=SN75LVDS387DGG&v=296; Stock1: 3,375